# EAGLE design schematic (EAGLE 9.0.1)
CNAME: FPGA NXT ROBOT ARM; CREVISION: A; DESIGNER: Luis Ernesto Fernández

## Sheet 1 of 4: FPGA I/O
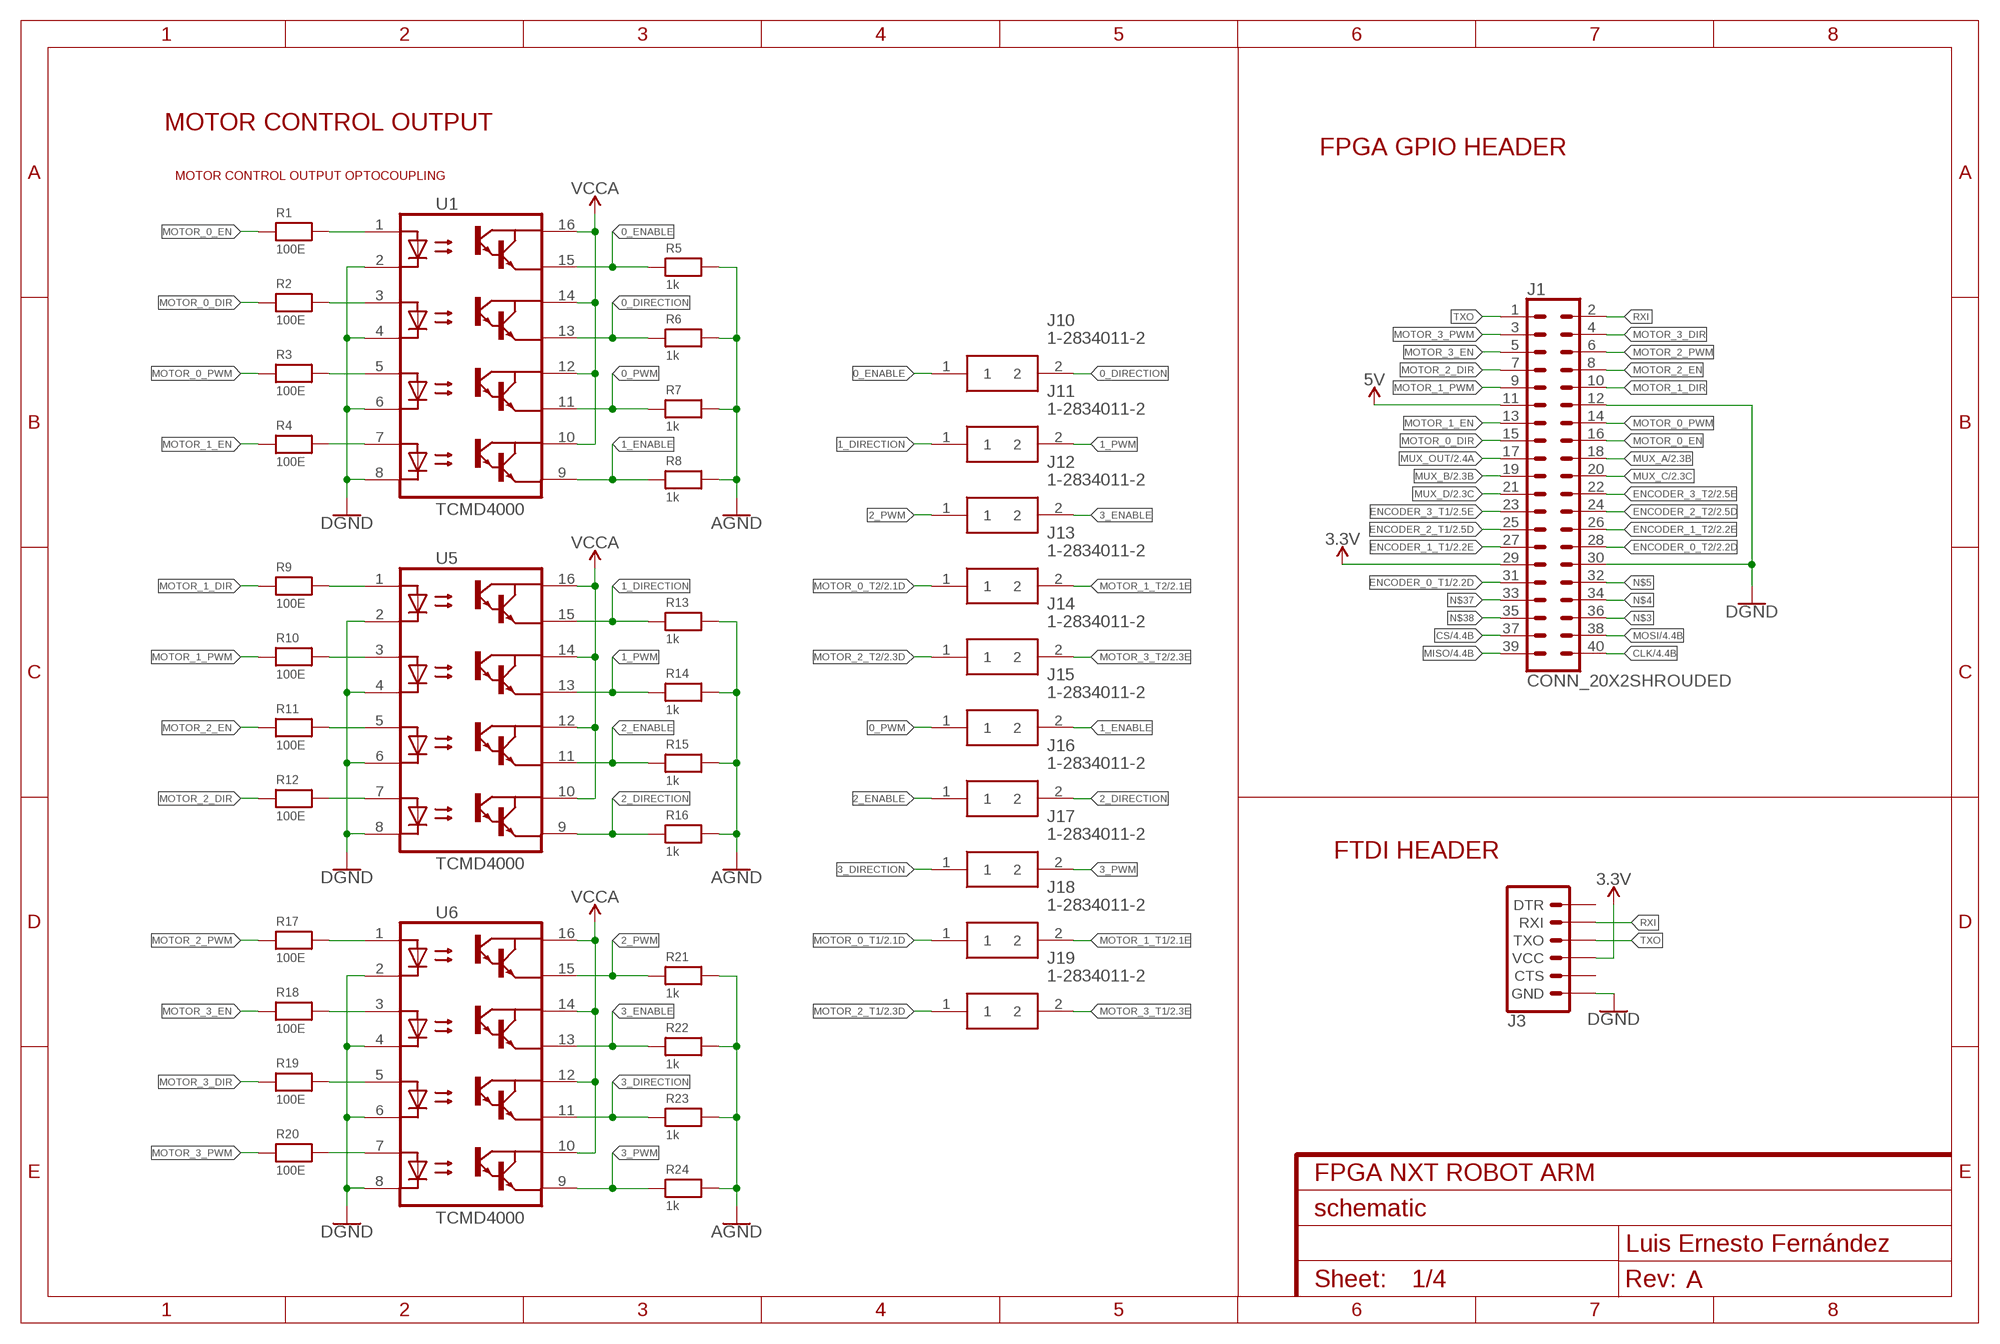
[diagram p0: schematic, sheet 1]

### Parts
J1  CONN_20X2SHROUDED  [2X20_SHROUDED]
J3  6_PIN_SERIAL_TARGET  [1X06]
J10  1-2834011-2  [128340112]
J11  1-2834011-2  [128340112]
J12  1-2834011-2  [128340112]
J13  1-2834011-2  [128340112]
J14  1-2834011-2  [128340112]
J15  1-2834011-2  [128340112]
J16  1-2834011-2  [128340112]
J17  1-2834011-2  [128340112]
J18  1-2834011-2  [128340112]
J19  1-2834011-2  [128340112]
R1  100E  RESISTOR0805_NOTHERMALS  [0805_NOTHERMALS]
R2  100E  RESISTOR0805_NOTHERMALS  [0805_NOTHERMALS]
R3  100E  RESISTOR0805_NOTHERMALS  [0805_NOTHERMALS]
R4  100E  RESISTOR0805_NOTHERMALS  [0805_NOTHERMALS]
R5  1k  RESISTOR0805_NOTHERMALS  [0805_NOTHERMALS]
R6  1k  RESISTOR0805_NOTHERMALS  [0805_NOTHERMALS]
R7  1k  RESISTOR0805_NOTHERMALS  [0805_NOTHERMALS]
R8  1k  RESISTOR0805_NOTHERMALS  [0805_NOTHERMALS]
R9  100E  RESISTOR0805_NOTHERMALS  [0805_NOTHERMALS]
R10  100E  RESISTOR0805_NOTHERMALS  [0805_NOTHERMALS]
R11  100E  RESISTOR0805_NOTHERMALS  [0805_NOTHERMALS]
R12  100E  RESISTOR0805_NOTHERMALS  [0805_NOTHERMALS]
R13  1k  RESISTOR0805_NOTHERMALS  [0805_NOTHERMALS]
R14  1k  RESISTOR0805_NOTHERMALS  [0805_NOTHERMALS]
R15  1k  RESISTOR0805_NOTHERMALS  [0805_NOTHERMALS]
R16  1k  RESISTOR0805_NOTHERMALS  [0805_NOTHERMALS]
R17  100E  RESISTOR0805_NOTHERMALS  [0805_NOTHERMALS]
R18  100E  RESISTOR0805_NOTHERMALS  [0805_NOTHERMALS]
R19  100E  RESISTOR0805_NOTHERMALS  [0805_NOTHERMALS]
R20  100E  RESISTOR0805_NOTHERMALS  [0805_NOTHERMALS]
R21  1k  RESISTOR0805_NOTHERMALS  [0805_NOTHERMALS]
R22  1k  RESISTOR0805_NOTHERMALS  [0805_NOTHERMALS]
R23  1k  RESISTOR0805_NOTHERMALS  [0805_NOTHERMALS]
R24  1k  RESISTOR0805_NOTHERMALS  [0805_NOTHERMALS]
U1  TCMD4000  [SOIC127P686X201-16N]
U5  TCMD4000  [SOIC127P686X201-16N]
U6  TCMD4000  [SOIC127P686X201-16N]

### Nets
0_DIRECTION: J10.2 R6.1 U1.13(E2)
0_ENABLE: J10.1 R5.1 U1.15(E1)
0_PWM: J15.1 R7.1 U1.11(E3)
1_DIRECTION: J11.1 R13.1 U5.15(E1)
1_ENABLE: J15.2 R8.1 U1.9(E4)
1_PWM: J11.2 R14.1 U5.13(E2)
2_DIRECTION: J16.2 R16.1 U5.9(E4)
2_ENABLE: J16.1 R15.1 U5.11(E3)
2_PWM: J12.1 R21.1 U6.15(E1)
3.3V: J1.29 J3.4(VCC) ; also sheet 2,3,4
3_DIRECTION: J17.1 R23.1 U6.11(E3)
3_ENABLE: J12.2 R22.1 U6.13(E2)
3_PWM: J17.2 R24.1 U6.9(E4)
5V: J1.11 ; also sheet 3,4
AGND: R5.2 R6.2 R7.2 R8.2 R13.2 R14.2 R15.2 R16.2 R21.2 R22.2 R23.2 R24.2 ; also sheet 2,3
CLK: J1.40 ; also sheet 4
CS: J1.37 ; also sheet 4
ENCODER_0_T1: J1.31 ; also sheet 2
ENCODER_0_T2: J1.28 ; also sheet 2
ENCODER_1_T1: J1.27 ; also sheet 2
ENCODER_1_T2: J1.26 ; also sheet 2
ENCODER_2_T1: J1.25 ; also sheet 2
ENCODER_2_T2: J1.24 ; also sheet 2
ENCODER_3_T1: J1.23 ; also sheet 2
ENCODER_3_T2: J1.22 ; also sheet 2
GND: J1.12 J1.30 J3.6(GND) U1.2(C1) U1.4(C2) U1.6(C3) U1.8(C4) U5.2(C1) U5.4(C2) U5.6(C3) U5.8(C4) U6.2(C1) U6.4(C2) U6.6(C3) U6.8(C4) ; supply symbol labelled DGND ; also sheet 2,3,4
MISO: J1.39 ; also sheet 4
MOSI: J1.38 ; also sheet 4
MOTOR_0_DIR: J1.15 R2.1
MOTOR_0_EN: J1.16 R1.1
MOTOR_0_PWM: J1.14 R3.1
MOTOR_0_T1: J18.1 ; also sheet 2
MOTOR_0_T2: J13.1 ; also sheet 2
MOTOR_1_DIR: J1.10 R9.1
MOTOR_1_EN: J1.13 R4.1
MOTOR_1_PWM: J1.9 R10.1
MOTOR_1_T1: J18.2 ; also sheet 2
MOTOR_1_T2: J13.2 ; also sheet 2
MOTOR_2_DIR: J1.7 R12.1
MOTOR_2_EN: J1.8 R11.1
MOTOR_2_PWM: J1.6 R17.1
MOTOR_2_T1: J19.1 ; also sheet 2
MOTOR_2_T2: J14.1 ; also sheet 2
MOTOR_3_DIR: J1.4 R19.1
MOTOR_3_EN: J1.5 R18.1
MOTOR_3_PWM: J1.3 R20.1
MOTOR_3_T1: J19.2 ; also sheet 2
MOTOR_3_T2: J14.2 ; also sheet 2
MUX_A: J1.18 ; also sheet 2
MUX_B: J1.19 ; also sheet 2
MUX_C: J1.20 ; also sheet 2
MUX_D: J1.21 ; also sheet 2
MUX_OUT: J1.17 ; also sheet 2
N$3: J1.36
N$4: J1.34
N$5: J1.32
N$37: J1.33
N$38: J1.35
N$57: R1.2 U1.1(A1)
N$58: R2.2 U1.3(A2)
N$59: R3.2 U1.5(A3)
N$60: R4.2 U1.7(A4)
N$118: R9.2 U5.1(A1)
N$119: R10.2 U5.3(A2)
N$120: R11.2 U5.5(A3)
N$121: R12.2 U5.7(A4)
N$122: R17.2 U6.1(A1)
N$123: R18.2 U6.3(A2)
N$124: R19.2 U6.5(A3)
N$125: R20.2 U6.7(A4)
RXI: J1.2 J3.2(RXI)
TXO: J1.1 J3.3(TXO)
VCCA: U1.10(CO4) U1.12(CO3) U1.14(CO2) U1.16(CO1) U5.10(CO4) U5.12(CO3) U5.14(CO2) U5.16(CO1) U6.10(CO4) U6.12(CO3) U6.14(CO2) U6.16(CO1) ; also sheet 2,3
Unconnected: J3.1(DTR) J3.5(CTS)

### Notes on the sheet
- MOTOR CONTROL OUTPUT
- FPGA GPIO HEADER
- MOTOR CONTROL OUTPUT OPTOCOUPLING
- FTDI HEADER

## Sheet 2 of 4: FPGA I/O
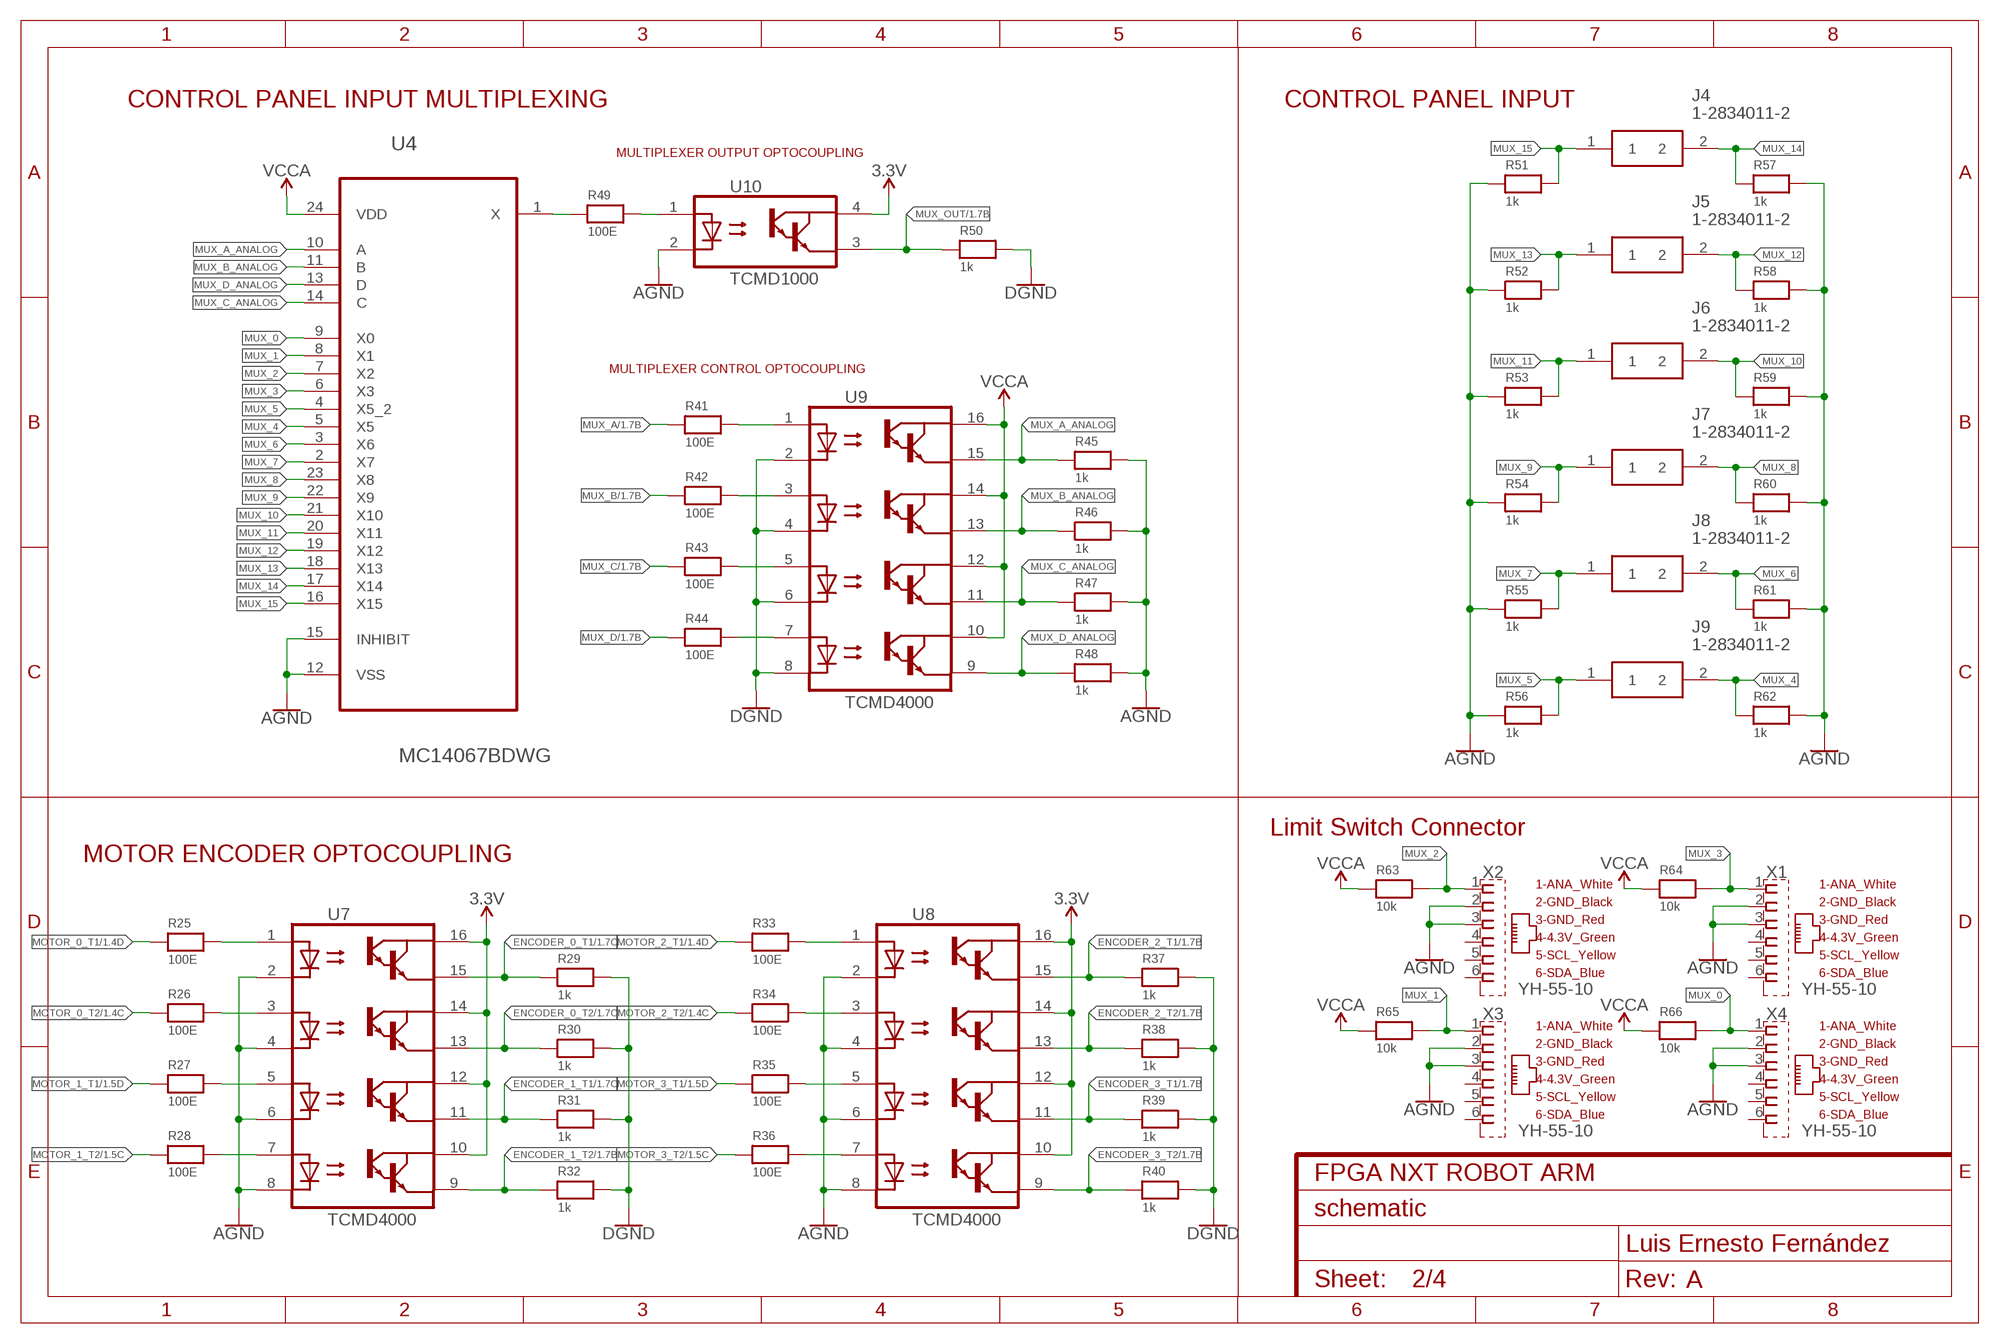
[diagram p1: schematic, sheet 2]

### Parts
J4  1-2834011-2  [128340112]
J5  1-2834011-2  [128340112]
J6  1-2834011-2  [128340112]
J7  1-2834011-2  [128340112]
J8  1-2834011-2  [128340112]
J9  1-2834011-2  [128340112]
R25  100E  RESISTOR0805_NOTHERMALS  [0805_NOTHERMALS]
R26  100E  RESISTOR0805_NOTHERMALS  [0805_NOTHERMALS]
R27  100E  RESISTOR0805_NOTHERMALS  [0805_NOTHERMALS]
R28  100E  RESISTOR0805_NOTHERMALS  [0805_NOTHERMALS]
R29  1k  RESISTOR0805_NOTHERMALS  [0805_NOTHERMALS]
R30  1k  RESISTOR0805_NOTHERMALS  [0805_NOTHERMALS]
R31  1k  RESISTOR0805_NOTHERMALS  [0805_NOTHERMALS]
R32  1k  RESISTOR0805_NOTHERMALS  [0805_NOTHERMALS]
R33  100E  RESISTOR0805_NOTHERMALS  [0805_NOTHERMALS]
R34  100E  RESISTOR0805_NOTHERMALS  [0805_NOTHERMALS]
R35  100E  RESISTOR0805_NOTHERMALS  [0805_NOTHERMALS]
R36  100E  RESISTOR0805_NOTHERMALS  [0805_NOTHERMALS]
R37  1k  RESISTOR0805_NOTHERMALS  [0805_NOTHERMALS]
R38  1k  RESISTOR0805_NOTHERMALS  [0805_NOTHERMALS]
R39  1k  RESISTOR0805_NOTHERMALS  [0805_NOTHERMALS]
R40  1k  RESISTOR0805_NOTHERMALS  [0805_NOTHERMALS]
R41  100E  RESISTOR0805_NOTHERMALS  [0805_NOTHERMALS]
R42  100E  RESISTOR0805_NOTHERMALS  [0805_NOTHERMALS]
R43  100E  RESISTOR0805_NOTHERMALS  [0805_NOTHERMALS]
R44  100E  RESISTOR0805_NOTHERMALS  [0805_NOTHERMALS]
R45  1k  RESISTOR0805_NOTHERMALS  [0805_NOTHERMALS]
R46  1k  RESISTOR0805_NOTHERMALS  [0805_NOTHERMALS]
R47  1k  RESISTOR0805_NOTHERMALS  [0805_NOTHERMALS]
R48  1k  RESISTOR0805_NOTHERMALS  [0805_NOTHERMALS]
R49  100E  RESISTOR0805_NOTHERMALS  [0805_NOTHERMALS]
R50  1k  RESISTOR0805_NOTHERMALS  [0805_NOTHERMALS]
R51  1k  RESISTOR0805_NOTHERMALS  [0805_NOTHERMALS]
R52  1k  RESISTOR0805_NOTHERMALS  [0805_NOTHERMALS]
R53  1k  RESISTOR0805_NOTHERMALS  [0805_NOTHERMALS]
R54  1k  RESISTOR0805_NOTHERMALS  [0805_NOTHERMALS]
R55  1k  RESISTOR0805_NOTHERMALS  [0805_NOTHERMALS]
R56  1k  RESISTOR0805_NOTHERMALS  [0805_NOTHERMALS]
R57  1k  RESISTOR0805_NOTHERMALS  [0805_NOTHERMALS]
R58  1k  RESISTOR0805_NOTHERMALS  [0805_NOTHERMALS]
R59  1k  RESISTOR0805_NOTHERMALS  [0805_NOTHERMALS]
R60  1k  RESISTOR0805_NOTHERMALS  [0805_NOTHERMALS]
R61  1k  RESISTOR0805_NOTHERMALS  [0805_NOTHERMALS]
R62  1k  RESISTOR0805_NOTHERMALS  [0805_NOTHERMALS]
R63  10k  RESISTOR0805_NOTHERMALS  [0805_NOTHERMALS]
R64  10k  RESISTOR0805_NOTHERMALS  [0805_NOTHERMALS]
R65  10k  RESISTOR0805_NOTHERMALS  [0805_NOTHERMALS]
R66  10k  RESISTOR0805_NOTHERMALS  [0805_NOTHERMALS]
U4  MC14067BDWG  [SOIC127P1030X265-24N]
U7  TCMD4000  [SOIC127P686X201-16N]
U8  TCMD4000  [SOIC127P686X201-16N]
U9  TCMD4000  [SOIC127P686X201-16N]
U10  TCMD1000  [SOIC254P695X210-4N]
X1  YH-55-10  [YH-55-10]
X2  YH-55-10  [YH-55-10]
X3  YH-55-10  [YH-55-10]
X4  YH-55-10  [YH-55-10]

### Nets
3.3V: U7.10(CO4) U7.12(CO3) U7.14(CO2) U7.16(CO1) U8.10(CO4) U8.12(CO3) U8.14(CO2) U8.16(CO1) U10.4(CO1) ; also sheet 1,3,4
AGND: R45.2 R46.2 R47.2 R48.2 R51.1 R52.1 R53.1 R54.1 R55.1 R56.1 R57.2 R58.2 R59.2 R60.2 R61.2 R62.2 U4.12(VSS) U4.15(INHIBIT) U7.2(C1) U7.4(C2) U7.6(C3) U7.8(C4) U8.2(C1) U8.4(C2) U8.6(C3) U8.8(C4) U10.2(C1) X1.2(2_GND_BLACK) X1.3(3_GND_RED) X2.2(2_GND_BLACK) X2.3(3_GND_RED) X3.2(2_GND_BLACK) X3.3(3_GND_RED) X4.2(2_GND_BLACK) X4.3(3_GND_RED) ; also sheet 1,3
ENCODER_0_T1: R29.1 U7.15(E1) ; also sheet 1
ENCODER_0_T2: R30.1 U7.13(E2) ; also sheet 1
ENCODER_1_T1: R31.1 U7.11(E3) ; also sheet 1
ENCODER_1_T2: R32.1 U7.9(E4) ; also sheet 1
ENCODER_2_T1: R37.1 U8.15(E1) ; also sheet 1
ENCODER_2_T2: R38.1 U8.13(E2) ; also sheet 1
ENCODER_3_T1: R39.1 U8.11(E3) ; also sheet 1
ENCODER_3_T2: R40.1 U8.9(E4) ; also sheet 1
GND: R29.2 R30.2 R31.2 R32.2 R37.2 R38.2 R39.2 R40.2 R50.2 U9.2(C1) U9.4(C2) U9.6(C3) U9.8(C4) ; supply symbol labelled DGND ; also sheet 1,3,4
MOTOR_0_T1: R25.1 ; also sheet 1
MOTOR_0_T2: R26.1 ; also sheet 1
MOTOR_1_T1: R27.1 ; also sheet 1
MOTOR_1_T2: R28.1 ; also sheet 1
MOTOR_2_T1: R33.1 ; also sheet 1
MOTOR_2_T2: R34.1 ; also sheet 1
MOTOR_3_T1: R35.1 ; also sheet 1
MOTOR_3_T2: R36.1 ; also sheet 1
MUX_0: R66.2 U4.9(X0) X4.1(1_ANA_WHITE)
MUX_1: R65.2 U4.8(X1) X3.1(1_ANA_WHITE)
MUX_2: R63.2 U4.7(X2) X2.1(1_ANA_WHITE)
MUX_3: R64.2 U4.6(X3) X1.1(1_ANA_WHITE)
MUX_4: J9.2 R62.1 U4.5(X5)
MUX_5: J9.1 R56.2 U4.4(X5_2)
MUX_6: J8.2 R61.1 U4.3(X6)
MUX_7: J8.1 R55.2 U4.2(X7)
MUX_8: J7.2 R60.1 U4.23(X8)
MUX_9: J7.1 R54.2 U4.22(X9)
MUX_10: J6.2 R59.1 U4.21(X10)
MUX_11: J6.1 R53.2 U4.20(X11)
MUX_12: J5.2 R58.1 U4.19(X12)
MUX_13: J5.1 R52.2 U4.18(X13)
MUX_14: J4.2 R57.1 U4.17(X14)
MUX_15: J4.1 R51.2 U4.16(X15)
MUX_A: R41.1 ; also sheet 1
MUX_A_ANALOG: R45.1 U4.10(A) U9.15(E1)
MUX_B: R42.1 ; also sheet 1
MUX_B_ANALOG: R46.1 U4.11(B) U9.13(E2)
MUX_C: R43.1 ; also sheet 1
MUX_C_ANALOG: R47.1 U4.14(C) U9.11(E3)
MUX_D: R44.1 ; also sheet 1
MUX_D_ANALOG: R48.1 U4.13(D) U9.9(E4)
MUX_OUT: R50.1 U10.3(E1) ; also sheet 1
N$69: R33.2 U8.1(A1)
N$70: R34.2 U8.3(A2)
N$71: R35.2 U8.5(A3)
N$80: R49.1 U4.1(X)
N$81: R36.2 U8.7(A4)
N$82: R49.2 U10.1(A1)
N$83: R41.2 U9.1(A1)
N$126: R25.2 U7.1(A1)
N$127: R26.2 U7.3(A2)
N$128: R27.2 U7.5(A3)
N$129: R28.2 U7.7(A4)
N$130: R42.2 U9.3(A2)
N$131: R43.2 U9.5(A3)
N$132: R44.2 U9.7(A4)
VCCA: R63.1 R64.1 R65.1 R66.1 U4.24(VDD) U9.10(CO4) U9.12(CO3) U9.14(CO2) U9.16(CO1) ; also sheet 1,3
Unconnected: X1.4(4_4.3V_GREEN) X1.5(5_SCL_YELLOW) X1.6(6_SDA_BLUE) X2.4(4_4.3V_GREEN) X2.5(5_SCL_YELLOW) X2.6(6_SDA_BLUE) X3.4(4_4.3V_GREEN) X3.5(5_SCL_YELLOW) X3.6(6_SDA_BLUE) X4.4(4_4.3V_GREEN) X4.5(5_SCL_YELLOW) X4.6(6_SDA_BLUE)

### Notes on the sheet
- CONTROL PANEL INPUT MULTIPLEXING | CONTROL PANEL INPUT
- MULTIPLEXER OUTPUT OPTOCOUPLING
- MULTIPLEXER CONTROL OPTOCOUPLING
- Limit Switch Connector
- MOTOR ENCODER OPTOCOUPLING

## Sheet 3 of 4: POWER DELIVERY
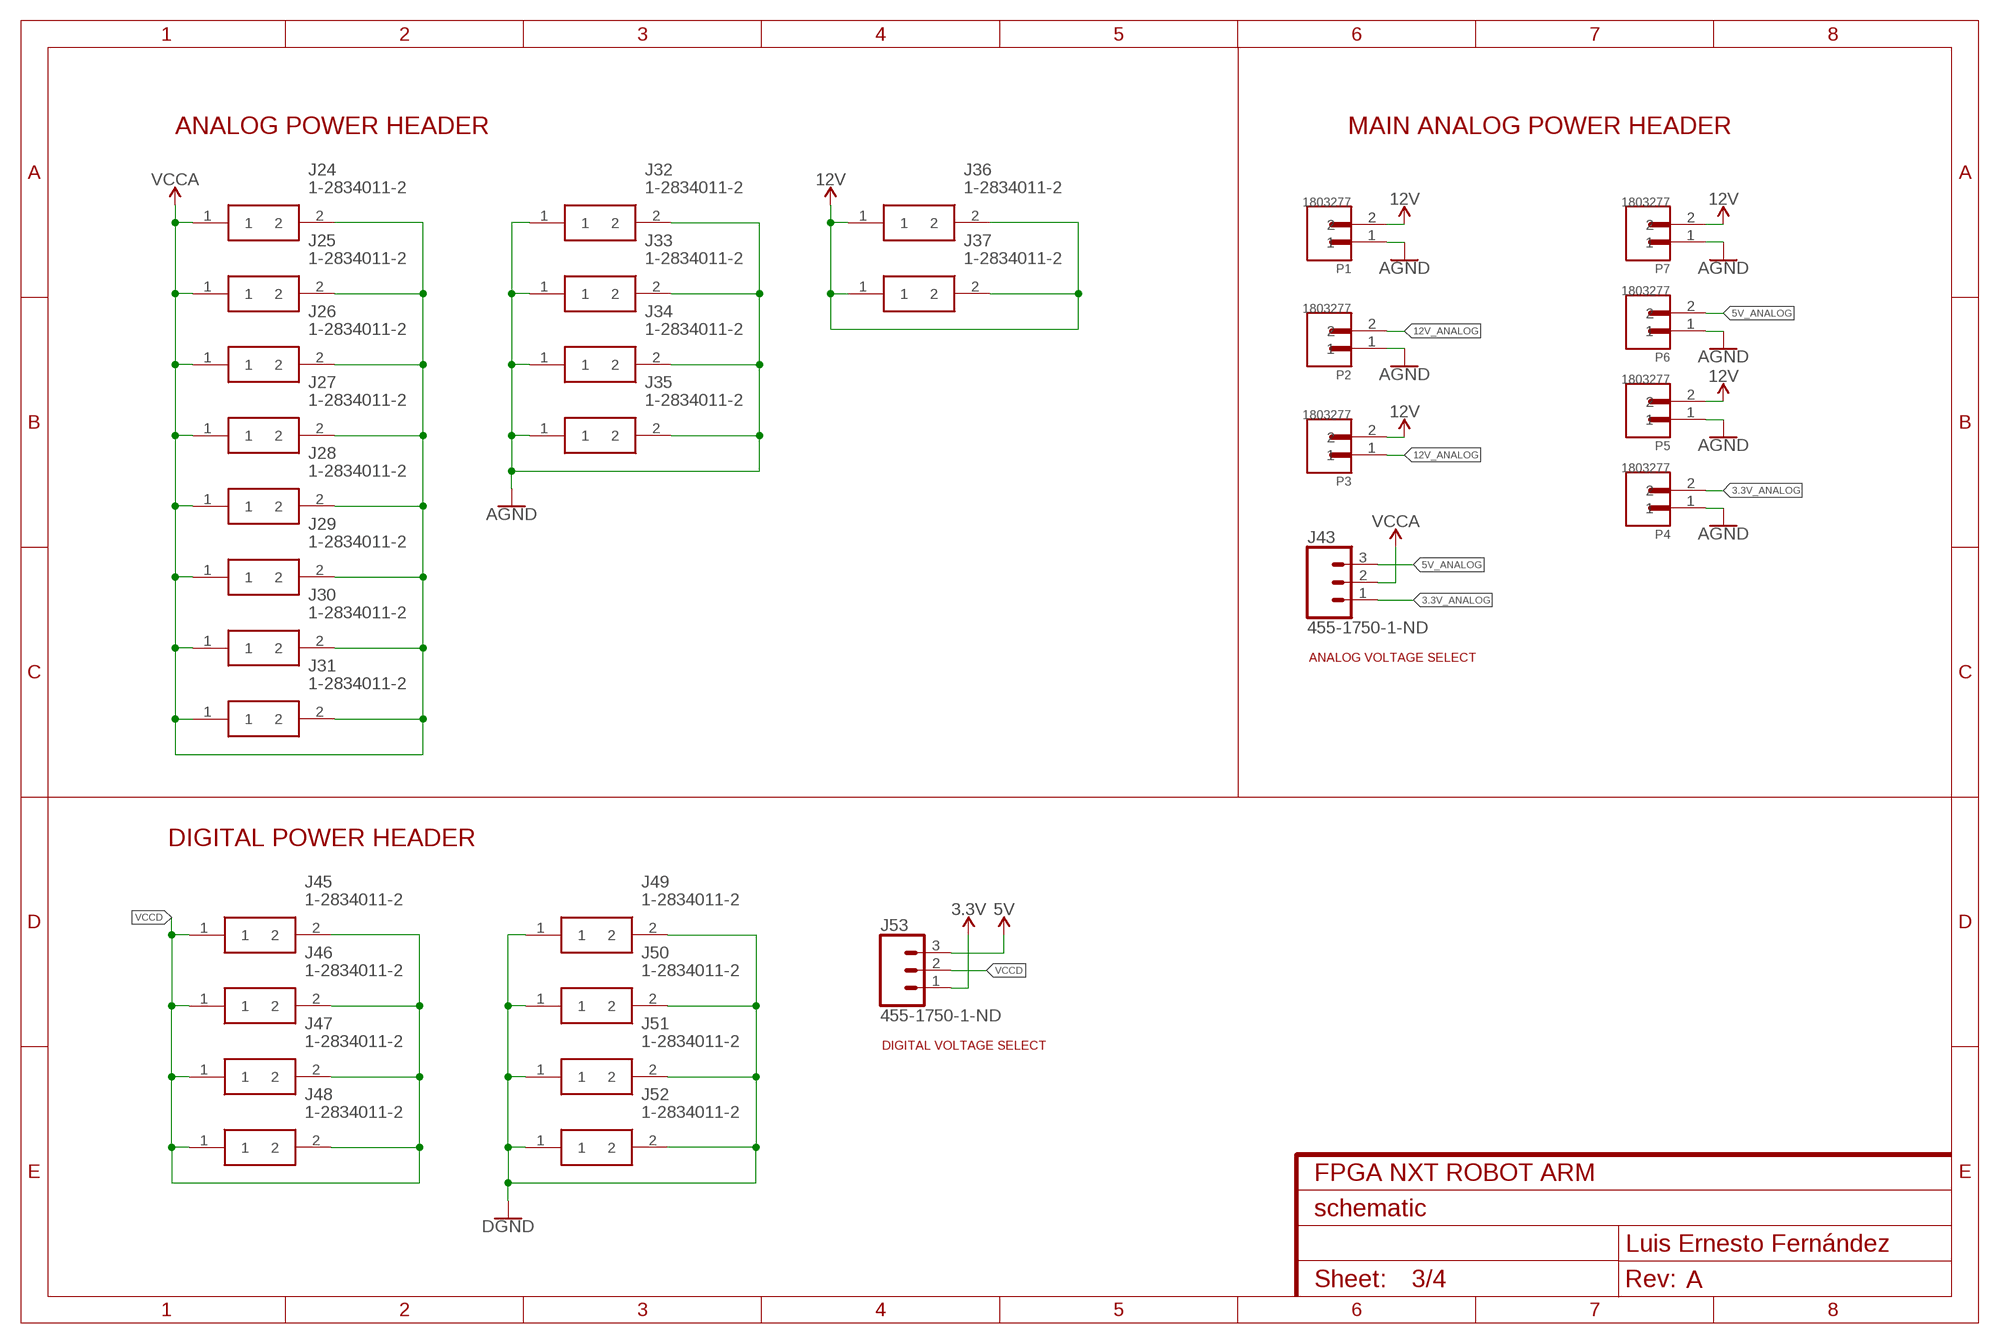
[diagram p2: schematic, sheet 3]

### Parts
J24  1-2834011-2  [128340112]
J25  1-2834011-2  [128340112]
J26  1-2834011-2  [128340112]
J27  1-2834011-2  [128340112]
J28  1-2834011-2  [128340112]
J29  1-2834011-2  [128340112]
J30  1-2834011-2  [128340112]
J31  1-2834011-2  [128340112]
J32  1-2834011-2  [128340112]
J33  1-2834011-2  [128340112]
J34  1-2834011-2  [128340112]
J35  1-2834011-2  [128340112]
J36  1-2834011-2  [128340112]
J37  1-2834011-2  [128340112]
J43  455-1750-1-ND  CONN_03  [1X03]
J45  1-2834011-2  [128340112]
J46  1-2834011-2  [128340112]
J47  1-2834011-2  [128340112]
J48  1-2834011-2  [128340112]
J49  1-2834011-2  [128340112]
J50  1-2834011-2  [128340112]
J51  1-2834011-2  [128340112]
J52  1-2834011-2  [128340112]
J53  455-1750-1-ND  CONN_03  [1X03]
P1  1803277  [PHOENIX_1803277]
P2  1803277  [PHOENIX_1803277]
P3  1803277  [PHOENIX_1803277]
P4  1803277  [PHOENIX_1803277]
P5  1803277  [PHOENIX_1803277]
P6  1803277  [PHOENIX_1803277]
P7  1803277  [PHOENIX_1803277]

### Nets
3.3V: J53.1 ; also sheet 1,2,4
3.3V_ANALOG: J43.1 P4.2
5V: J53.3 ; also sheet 1,4
5V_ANALOG: J43.3 P6.2
12V: J36.1 J36.2 J37.1 J37.2 P1.2 P3.2 P5.2 P7.2
12V_ANALOG: P2.2 P3.1
AGND: J32.1 J32.2 J33.1 J33.2 J34.1 J34.2 J35.1 J35.2 P1.1 P2.1 P4.1 P5.1 P6.1 P7.1 ; also sheet 1,2
GND: J49.1 J49.2 J50.1 J50.2 J51.1 J51.2 J52.1 J52.2 ; supply symbol labelled DGND ; also sheet 1,2,4
VCCA: J24.1 J24.2 J25.1 J25.2 J26.1 J26.2 J27.1 J27.2 J28.1 J28.2 J29.1 J29.2 J30.1 J30.2 J31.1 J31.2 J43.2 ; also sheet 1,2
VCCD: J45.1 J45.2 J46.1 J46.2 J47.1 J47.2 J48.1 J48.2 J53.2

### Notes on the sheet
- ANALOG POWER HEADER | MAIN ANALOG POWER HEADER
- ANALOG VOLTAGE SELECT
- DIGITAL POWER HEADER
- DIGITAL VOLTAGE SELECT

## Sheet 4 of 4: ADC
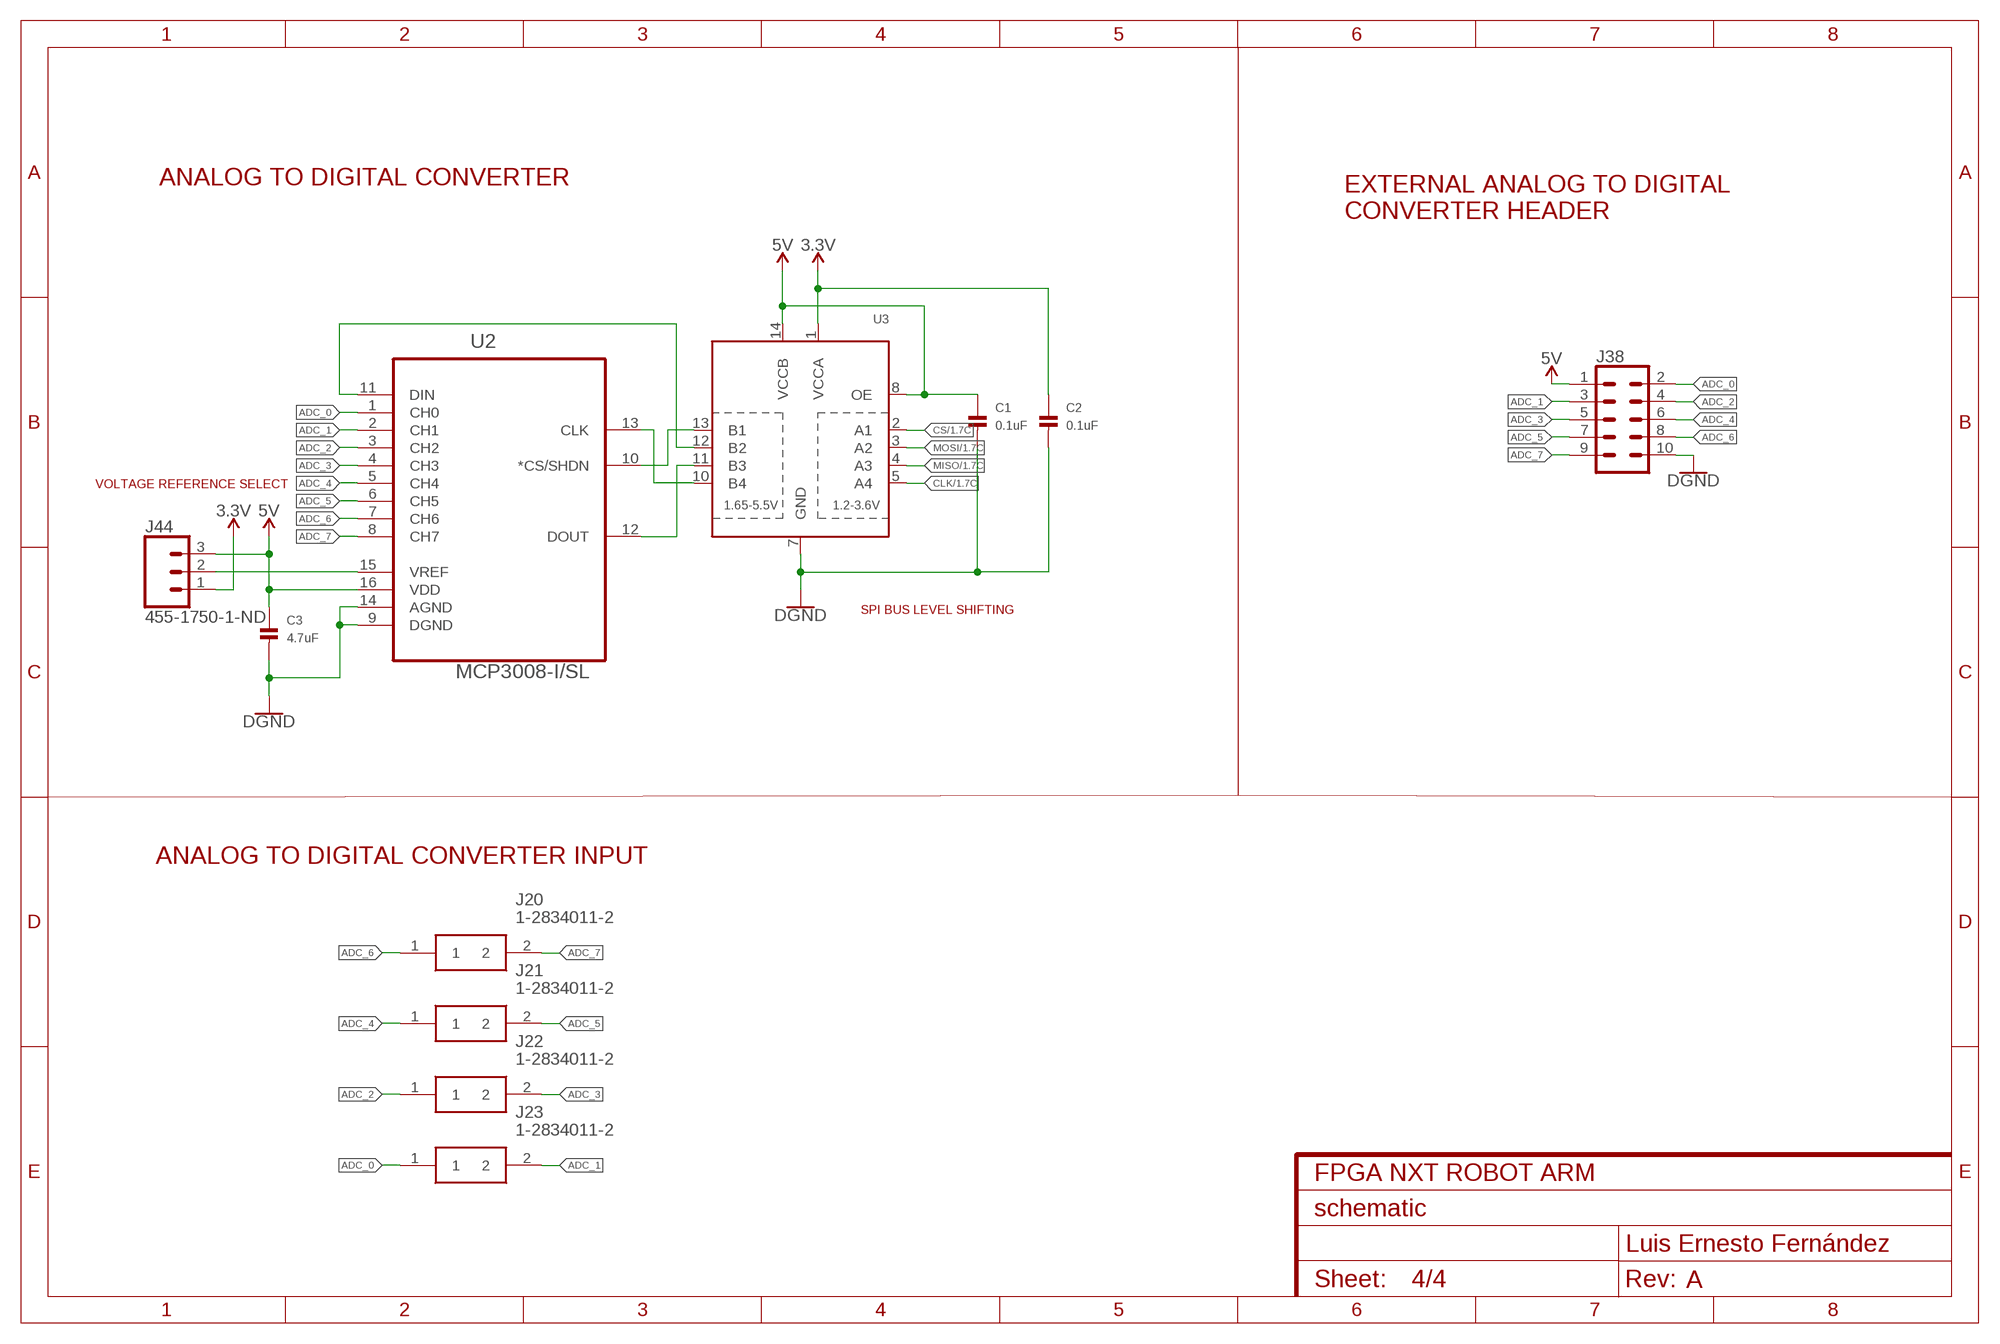
[diagram p3: schematic, sheet 4]

### Parts
C1  0.1uF  CAP_CERAMIC0805-NOTHERMALS  [0805_NOTHERMALS]
C2  0.1uF  CAP_CERAMIC0805-NOTHERMALS  [0805_NOTHERMALS]
C3  4.7uF  CAP_CERAMIC0805-NOTHERMALS  [0805_NOTHERMALS]
J20  1-2834011-2  [128340112]
J21  1-2834011-2  [128340112]
J22  1-2834011-2  [128340112]
J23  1-2834011-2  [128340112]
J38  CONN_05X2SHD  [2X5-SHROUDED]
J44  455-1750-1-ND  CONN_03  [1X03]
U2  MCP3008-I/SL  [SOIC127P600X175-16N]
U3  TXB0104PWR  [TSSOP14]

### Nets
3.3V: C2.1 J44.1 U3.1(VCCA) ; also sheet 1,2,3
5V: C1.1 C3.1 J38.1 J44.3 U2.16(VDD) U3.8(OE) U3.14(VCCB) ; also sheet 1,3
ADC_0: J23.1 J38.2 U2.1(CH0)
ADC_1: J23.2 J38.3 U2.2(CH1)
ADC_2: J22.1 J38.4 U2.3(CH2)
ADC_3: J22.2 J38.5 U2.4(CH3)
ADC_4: J21.1 J38.6 U2.5(CH4)
ADC_5: J21.2 J38.7 U2.6(CH5)
ADC_6: J20.1 J38.8 U2.7(CH6)
ADC_7: J20.2 J38.9 U2.8(CH7)
CLK: U3.5(A4) ; also sheet 1
CS: U3.2(A1) ; also sheet 1
GND: C1.2 C2.2 C3.2 J38.10 U2.9(DGND) U2.14(AGND) U3.7(GND) ; supply symbol labelled DGND ; also sheet 1,2,3
MISO: U3.4(A3) ; also sheet 1
MOSI: U3.3(A2) ; also sheet 1
N$1: U2.10(*CS/SHDN) U3.13(B1)
N$2: U2.12(DOUT) U3.11(B3)
N$6: U2.13(CLK) U3.10(B4)
N$15: U2.11(DIN) U3.12(B2)
N$112: J44.2 U2.15(VREF)

### Notes on the sheet
- ANALOG TO DIGITAL CONVERTER
- EXTERNAL ANALOG TO DIGITAL
  CONVERTER HEADER
- VOLTAGE REFERENCE SELECT
- SPI BUS LEVEL SHIFTING
- ANALOG TO DIGITAL CONVERTER INPUT

## Library data of the parts
C1-C3 = microbuilder:CAP_CERAMIC: Ceramic Capacitors 0402 - 0402 Surface Mount Capacitors 16pF 50V 5% [Digikey: 445-4899-2-ND] 18pF 50V 5% [Digikey: 490-1281-2-ND] 22pF 50V 5% [Digikey: 490-1283-2-ND] 68pF 50V 5% [Digikey: 490-1289-2-ND] 0.1uF 10V 10% [Digikey: 490-1318-2-ND] 1.0uF 6.3V 10% [Digikey: 490-1320-2-ND] 0603 - 0603 Surface Mount Capacitors 16 pF 50V 5% [Digikey: 445-5051-2-ND] 22 pF 50V [Digikey: PCC220ACVTR-ND] 33 pF 50V 5% [Digikey: 490-1415-1-ND] 56pF 50V 5% [Digikey: 490-1421-1-ND] 220pF 50V 5% [Digikey: 445-1285-1-ND] 680 pF 50V 2200 pF 50V 5% C0G [Digikey: 445-1297-1-ND] 5600 pF 100V 5% X7R [Digikey: 478-3711-1-ND] 0.1 µF 25V 10% [Digikey: PCC2277TR-ND] 0.22 µF 16V 10% X7R [Digikey: 445-1318-1-ND] 1.0 µF 25V 10% [Digikey: 445-5146-2-ND] 0603 - RF Specific 3pF 250V +/-0.1pF RF [Digikey: 712-1347-1-ND] 18 pF 250V 5% [Digikey: 478-3505-1-ND or 712-1322-1-ND] 56 pF 250V 5% C0G RF [Digikey: 490-4867-1-ND] 68 pF 250V RF [Digikey: 490-4868-1-ND] 0805 - 0805 Surface Mount Capacitors 220 pF 250V 2% RF Ceramic Capacitor [Digikey: 712-1398-1-ND] 1000 pF 50V 2% NP0 Ceramic Capacitor [Digikey: 478-3760-1-ND] 0.1 µF 25V 10% Ceramic Capacitor [Digikey: PCC1828TR-ND] 1.0 µF 16V 10% Ceramic Capacitor[Digikey: 490-1691-2-ND] 10.0 µF 10V 10% Ceramic Capacitor[Digikey: 709-1228-1-ND] 10.0 uF 16V 10% Ceramic Capacitor [Digikey: 478-5165-2-ND] 47 uF 6.3V 20% Ceramic Capacitor [Digikey: 587-1779-1-ND or 399-5506-1-ND] 1206 - 1206 Surface Mount Capacitors 47uF 10V 20% Ceramic Capacitor [Digikey: 490-5528-1-ND or 399-5508-1-ND or 445-6010-1-ND] 100uF 6.3V -20%, +80% Y5V Ceramic Capacitor (Digikey: 490-4512-1-ND, Mouser: 81-GRM31CF50J107ZE1L)
J1 = SparkFun-Connectors:CONN_20X2: Multi connection point. Often used as Generic Header-pin footprint for 0.1 inch spaced/style header connections On any of the 0.1 inch spaced packages, you can populate with these: Break Away Headers - Straight <https://www.sparkfun.com/products/116> (PRT-00116) Break Away Male Headers - Right Angle <https://www.sparkfun.com/products/553> (PRT-00553) Female Headers <https://www.sparkfun.com/products/115> (PRT-00115) Break Away Headers - Machine Pin <https://www.sparkfun.com/products/117> (PRT-00117) Break Away Female Headers - Swiss Machine Pin <https://www.sparkfun.com/products/743> (PRT-00743); PROD_ID: CONN-12263; SF_ID: CONN-12263
J3 = SparkFun-Connectors:6_PIN_SERIAL_TARGET: 6-pin header connection for use with the "FTDI BASIC" pinout - TARGET SIDE. Also known as "Arduino Serial Program Header". It is used to mate with our FTDI Basic serial programmers using the Arduino IDE. Note, this device has "TARGET" in the name. It is intended to be used on a design that contains a target micro-controller that you wish to program. The "sister" device, named "CABLE" is inteneded to be used on a design that usually lives on the end of your USB cable and prvides the converter chip (FTDI232 or FTDI231x) to commnicate serial RX/TX. You can populate with some of these: Break Away Headers - Straight <https://www.sparkfun.com/products/116> (PRT-00116) For reference (or to suit your programming needs) check out these designs: SparkFun FTDI Basic Breakout - 5V <https://www.sparkfun.com/products/9716> (DEV-09716) SparkFun FTDI Basic Breakout - 3.3V <https://www.sparkfun.com/products/9873> (DEV-09873) SparkFun FTDI SmartBasic <https://www.sparkfun.com/products/12935> (DEV-12935) SparkFun Beefy 3 - FTDI Basic Breakout <https://www.sparkfun.com/products/13746> (DEV-13746)
J4-J37 J45-J52 = 1-2834011-2:1-2834011-2: 2P 3.5mm Top Entry Screwless Connector. TE Connectivity 3.5mm Pitch Vertical PCB Terminal Block with Solder Termination, Through Hole, 2 Way Source: Datasheet <http://www.te.com/commerce/DocumentDelivery/DDEController?Action=showdoc&DocId=Customer Drawing2834011BpdfEnglishENG_CD_2834011_B.pdf1-2834011-2>; ARROW_PART_NUMBER: 1-2834011-2; ARROW_PRICE/STOCK: https://www.arrow.com/en/products/1-2834011-2/te-connectivity; DESCRIPTION: 2P 3.5mm Top Entry Screwless Connector. TE Connectivity 3.5mm Pitch Vertical PCB Terminal Block with Solder Termination, Through Hole, 2 Way; HEIGHT: 11mm; MANUFACTURER_NAME: TE Connectivity; MANUFACTURER_PART_NUMBER: 1-2834011-2; RS_PART_NUMBER: 1649131; RS_PRICE/STOCK: http://uk.rs-online.com/web/p/products/1649131
J38 = SparkFun-Connectors:CONN_05X2: Multi connection point. Often used as Generic Header-pin footprint for 0.1 inch spaced/style header connections For AVR SPI programming port, see special device with nice symbol: "AVR_SPI_PROG_5x2.dev" You can populate with any combo of single row headers, but if you'd like an exact match, check these: 2x5 AVR ICSP Male Header <https://www.sparkfun.com/products/778> (PRT-00778) 2x5 Pin Shrouded Header <https://www.sparkfun.com/products/8506> (PRT-08506) On any of the 0.1 inch spaced packages, you can populate with these: Break Away Headers - Straight <https://www.sparkfun.com/products/116> (PRT-00116) Break Away Male Headers - Right Angle <https://www.sparkfun.com/products/553> (PRT-00553) Female Headers <https://www.sparkfun.com/products/115> (PRT-00115) Break Away Headers - Machine Pin <https://www.sparkfun.com/products/117> (PRT-00117) Break Away Female Headers - Swiss Machine Pin <https://www.sparkfun.com/products/743> (PRT-00743) Special note: the shrouded connector mates well with our 5x2 ribbon cables: 2x5 Pin IDC Ribbon Cable <https://www.sparkfun.com/products/8535> (PRT-08535); PROD_ID: CONN-08671; SF_ID: PRT-08506
J43 J44 J53 = SparkFun-Connectors:CONN_03: Multi connection point. Often used as Generic Header-pin footprint for 0.1 inch spaced/style header connections On any of the 0.1 inch spaced packages, you can populate with these: Break Away Headers - Straight <https://www.sparkfun.com/products/116> (PRT-00116) Break Away Male Headers - Right Angle <https://www.sparkfun.com/products/553> (PRT-00553) Female Headers <https://www.sparkfun.com/products/115> (PRT-00115) Break Away Headers - Machine Pin <https://www.sparkfun.com/products/117> (PRT-00117) Break Away Female Headers - Swiss Machine Pin <https://www.sparkfun.com/products/743> (PRT-00743) Stackable Header - 3 Pin (Female, 0.1") <https://www.sparkfun.com/products/13875> (PRT-13875) For SCREWTERMINALS and SPRING TERMINALS visit here: Screw Terimnals on SparkFun.com <https://www.sparkfun.com/search/results?term=Screw+Terminals> (5mm/3.5mm/2.54mm spacing) This device is also useful as a general connection point to wire up your design to another part of your project. Our various solder wires solder well into these plated through hole pads. Hook-Up Wire - Assortment (Stranded, 22 AWG) <https://www.sparkfun.com/products/11375> (PRT-11375) Hook-Up Wire - Assortment (Solid Core, 22 AWG) <https://www.sparkfun.com/products/11367> (PRT-11367) View the entire wire category on our website here <https://www.sparkfun.com/categories/141> Special notes: Molex polarized connector foot print use with SKU : PRT-08232 with associated crimp pins and housings.; PROD_ID: XXX-00000
P1-P7 = 1803277:1803277: Mini-Combicon Series Plug In Parallel To Pcb 2pos 8a 160vac Green Plastic Housing 3.81mm Pitch 3.81mm Length; AVAILABILITY: Bad; DESCRIPTION: Gel Highlighter Set 5 Colour s; MF: Phoenix Contact; MP: 1803277; PACKAGE: FakePackage N; PRICE: 13.65 USD
R1-R66 = microbuilder:RESISTOR: Resistors 0402 - 0402 Surface Mount Package 22 Ohm 1% 1/16W [Digikey: 311-22.0LRTR-ND] 33 Ohm 5% 1/16W 1.0K 5% 1/16W 1.5K 5% 1/16W 2.0K 1% 1/16W 10.0K 1% 1/16W [Digikey: 311-10.0KLRTR-ND] 10.0K 5% 1/16W [Digikey: RMCF0402JT10K0TR-ND] 12.1K 1% 1/16W [Digikey: 311-22.0LRTR-ND] 100.0K 5% 1/16W 0603 - 0603 Surface Mount Package 0 Ohm 1/10 Watt 1% Resistor 15 Ohm 1/10 Watt 1% Resistor 33 Ohm 1/10 Watt 1% Resistor 49.9 Ohm 1/10 Watt 1% Resistor 100 Ohm 1/10 Watt 1% Resistor 150 Ohm 1/10 Watt 1% Resistor 240 Ohm 1/10 Watt 1% Resistor 390 Ohm 1/10 Watt 1% Resistor 560 Ohm 1/10 Watt 1% Resistor 680 Ohm 1/10 Watt 1% Resistor 750 Ohm 1/10 Watt 1% Resistor 1.0K Ohm 1/10 Watt 1% Resistor 1.5K Ohm 1/10 Watt 1% Resistor 2.0K Ohm 1/10 Watt 1% Resistor 2.2K Ohm 1/10 Watt 1% Resistor 3.3K Ohm 1/10 Watt 1% Resistor 4.7K Ohm 1/10 Watt 1% Resistor 10.0K Ohm 1/10 Watt 1% Resistor 12.0K Ohm 1/10 Watt 1% Resistor 12.1K Ohm 1/10 Watt 1% Resistor 20.0K Ohm 1/10 Watt 1% Resistor 33.0K Ohm 1/10 Watt 1% Resistor 100.0K Ohm 1/10 Watt 1% Resistor 0805 - 0805 Surface Mount Package 0 Ohm 1/8 Watt 1% Resistor 33 Ohm 1/8 Watt 1% Resistor 100 Ohm 1/8 Watt 1% Resistor 150 Ohm 1/8 Watt 1% Resistor 200 Ohm 1/8 Watt 1% Resistor 240 Ohm 1/8 Watt 1% Resistor 330 Ohm 1/8 Watt 1% Resistor 390 Ohm 1/8 Watt 1% Resistor 470 Ohm 1/8 Watt 1% Resistor 1.0K Ohm 1/8 Watt 1% Resistor 1.5K Ohm 1/8 Watt 1% Resistor 2.0K Ohm 1/8 Watt 1% Resistor 4.7K Ohm 1/8 Watt 1% Resistor 5.1K Ohm 1/8 Watt 1% Resistor 5.6K Ohm 1/8 Watt 1% Resistor 10.0K Ohm 1/8 Watt 1% Resistor 22.0K Ohm 1/8 Watt 1% Resistor 33.0K Ohm 1/8 Watt 1% Resistor 100K Ohm 1/8 Watt 1% Resistor 1206 - 1206 Surface Mount Package 2012 - 2010 Surface Mount Package 0.11 Ohm 1/2 Watt 1% Resistor - Digikey: RHM.11UCT-ND
U1 U5-U9 = TCMD4000:TCMD4000: Optocoupler, Photodarlington Output, High Gain, Single/Quad Channel, Half Pitch Mini-Flat Package; AVAILABILITY: Good; DESCRIPTION: TCMD4000 Series Quad Channel 35V 3750 Vrms Photodarlington Optocoupler - SOIC-16; MF: Vishay Semiconductor; MP: TCMD4000; PACKAGE: SOP-16 Vishay Semiconductor; PRICE: 1.38 USD
U2 = MCP3008-I_SL:MCP3008-I/SL: 10BIT ADC, 8 CH, SPI, SMD; AVAILABILITY: Good; DESCRIPTION: Eight Channel SPI Serial Interface 2.7 V 10-Bit A/D Converter SMT - SOIC-16; MF: Microchip; MP: MCP3008-I/SL; PACKAGE: SOIC-16 Microchip; PRICE: 2.09 USD
U3 = adafruit:TXB0104PWR: 4-Bit Bi-Directional Level Shifter 1.2V-3.6V (VCCA) to 1.65V-5.5V (VCCB) bi-directional level shifter with auto direction sensing. Max data rate - VCCA 1.8V: 20Mbps (50ns), VCCA 3.3V: 100Mbps (10ns) Digikey: 296-21929-1-ND
U4 = ON Semiconductor_By_element14_Batch_1:MC14067BDWG: Analog Multiplexers/Demultiplexers; MPN: MC14067BDWG; OC_FARNELL: 9664882; OC_NEWARK: 45J1070; PACKAGE: SOIC-24; SUPPLIER: On Semiconductor
U10 = TCMD1000:TCMD1000: Optocoupler, Photodarlington Output, High Gain, Single Channel, Half Pitch Mini-Flat Package; AVAILABILITY: Good; DESCRIPTION: Single Channel 35 V 3750 Vrms 600% CTR Photodarlington Optocoupler - SOP-4; MF: Vishay; MP: TCMD1000; PACKAGE: SOP-4 Vishay; PRICE: 0.40 USD
X1-X4 = Dexter_Industries_Eagle_Library_Female_Sockets:YH-55-10: RJ11 6 connects Source:Dexter Industries LEGO MINDSTORMS NXT Female Adapter; OC_FARNELL: unknown; OC_NEWARK: unknown

## Board
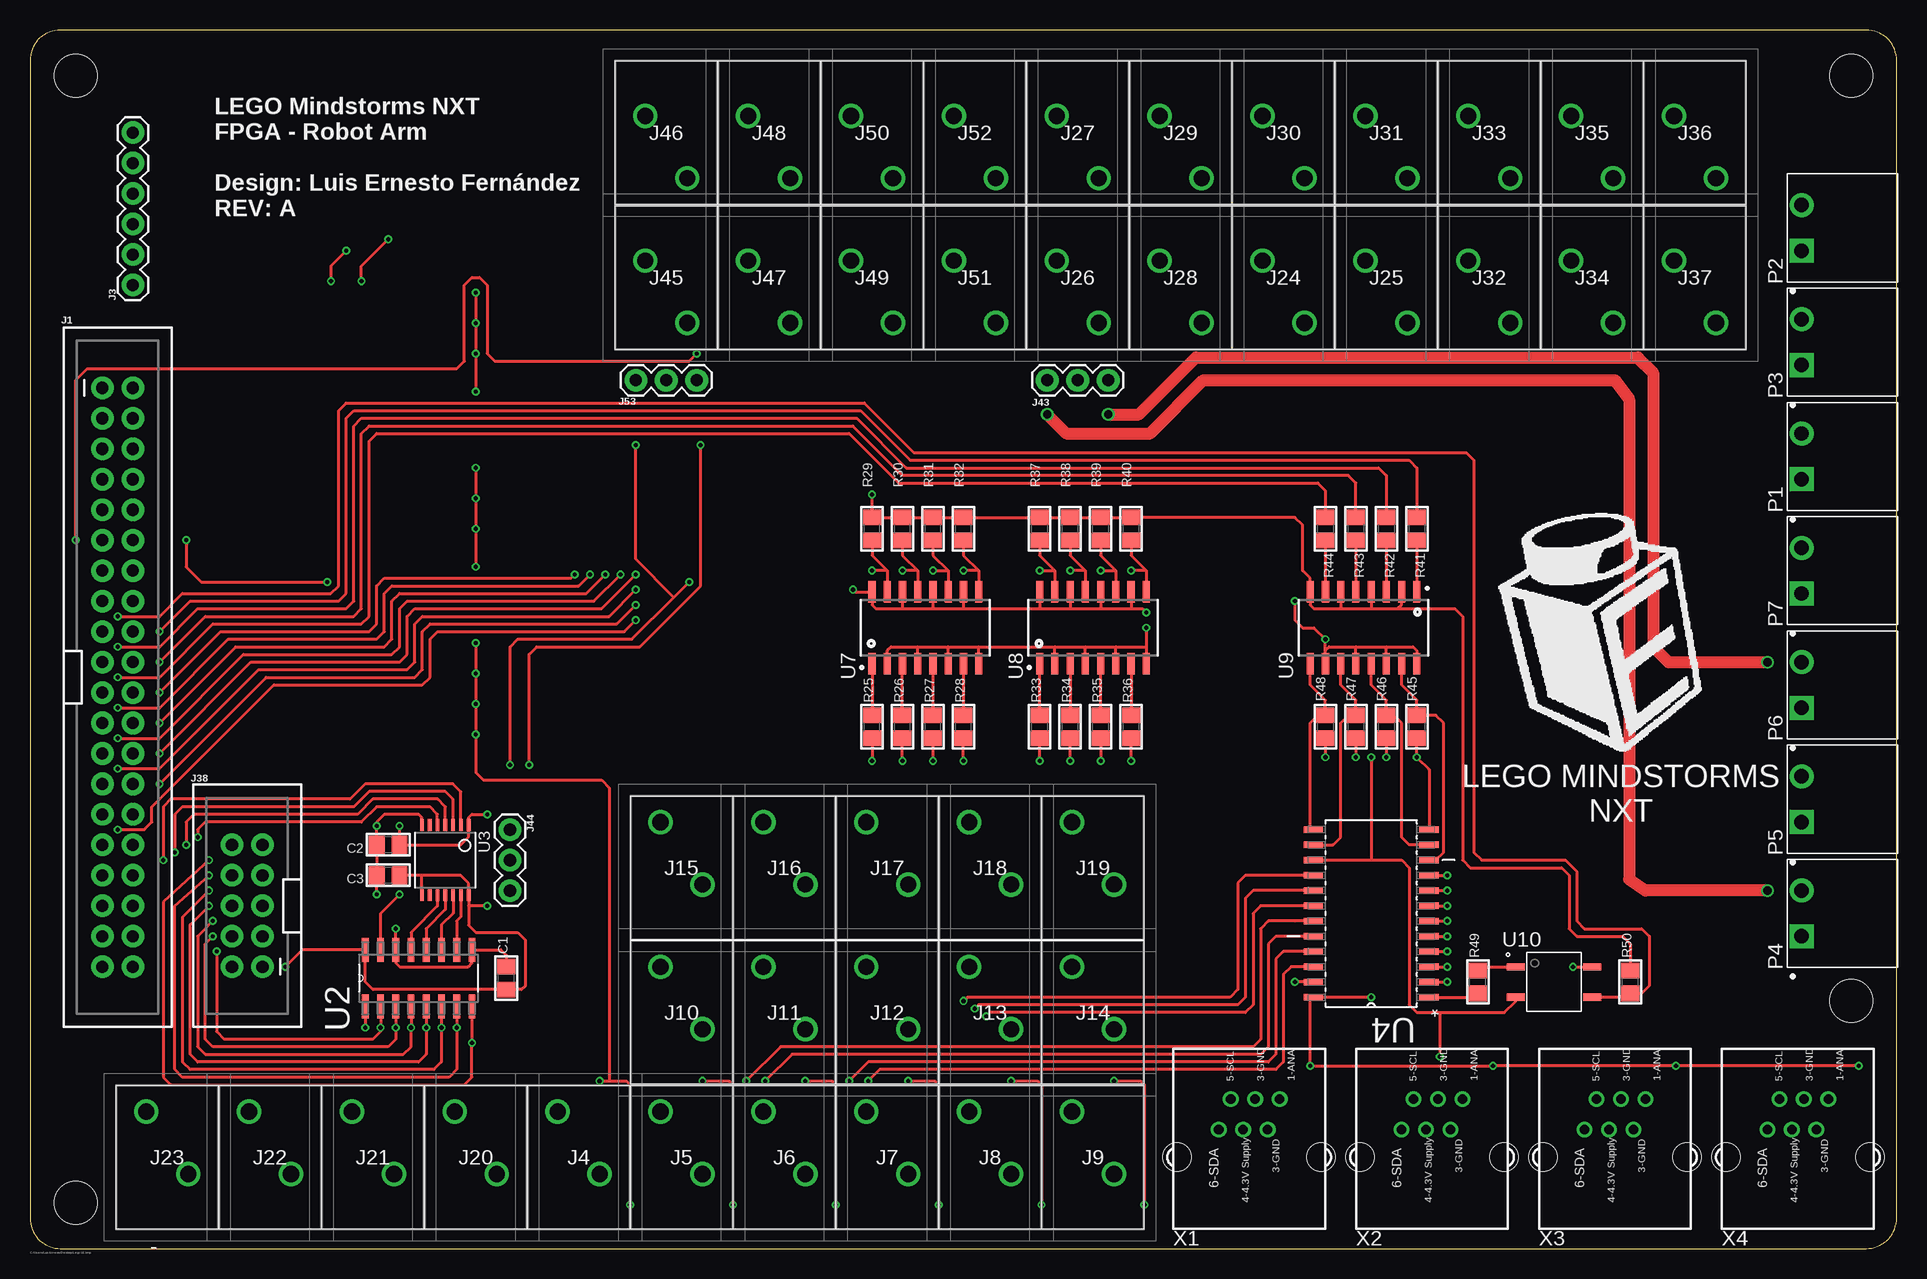
[diagram p4: board, top side]
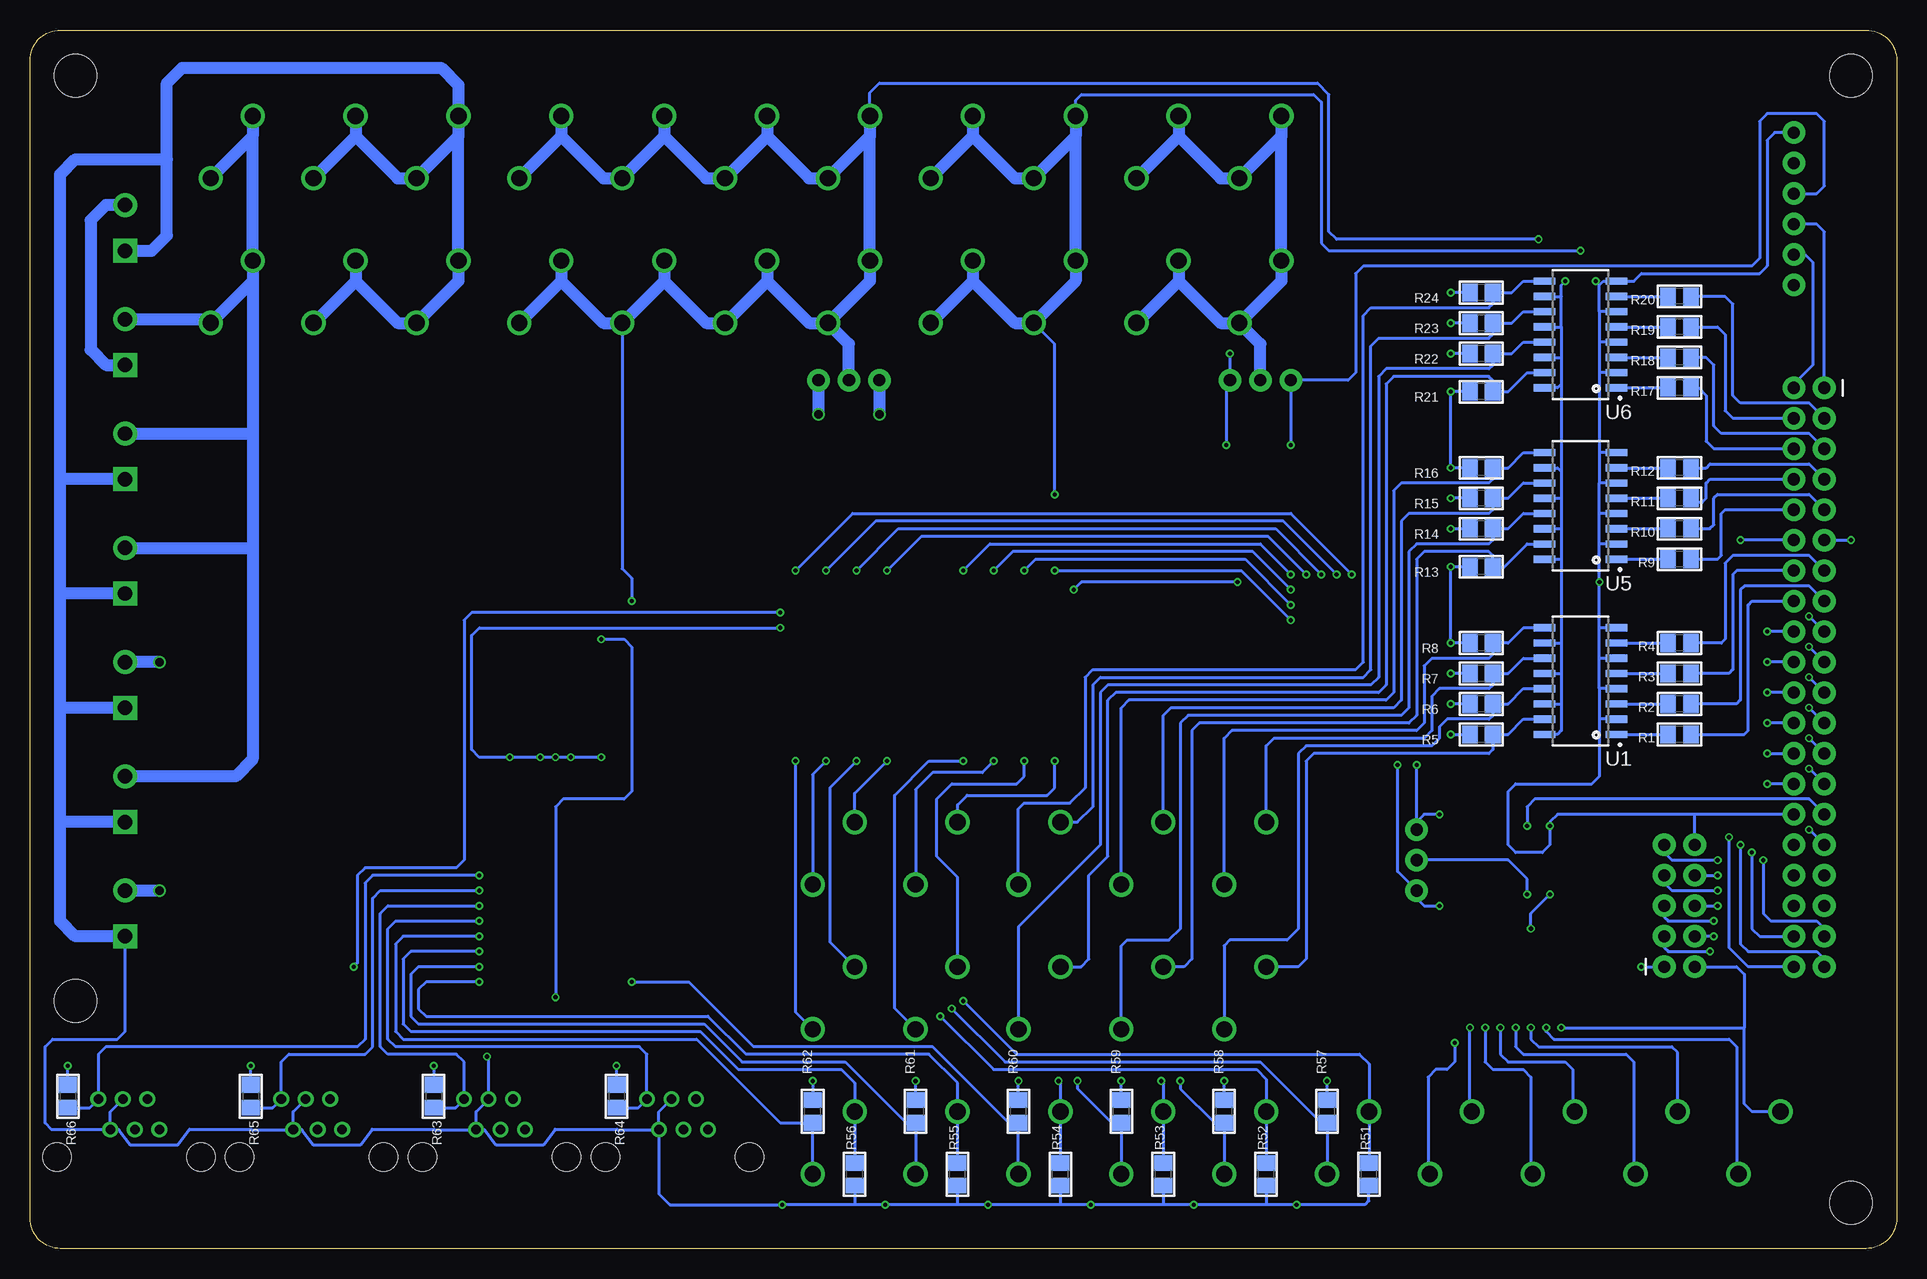
[diagram p5: board, bottom side, seen from below]

Size 155.56 x 101.59 mm. Coordinates in mm from the lower left corner, seen from the top.
Outline: 153.01,101.59 2.54,101.59 arc90 0,99.05 0,2.54 arc90 2.54,0 153.01,0 arc90 155.56,2.54 155.56,99.05 arc90 153.01,101.59
Copper layers (1*16): Top 0.035mm / dielectric 1.5mm / Bottom 0.035mm
Design rules "SeeedStudio_2layer_DRU_no_angle_20140221": minimum track width 6mil, minimum drill 12mil, track to track 6mil, track to pad 6mil, pad to pad 6mil, via to via 6mil, smd to smd 0mil, copper to edge 10mil, drill to drill 10mil, minimum pad ring 10mil, minimum via ring 6mil, stop-mask expansion 2mil, vias tented up to drill 100mil, thermal gap 10mil
Holes 3.56 mm at 151.76,97.79 3.81,3.81 151.76,20.64 3.81,97.79

### Footprints (pad centres in the part's own frame; a part is rotated, then mirrored left to right if it is on the bottom)
0805_NOTHERMALS = smd 1.3 x 1.5: 1 -0.95,0; 2 0.95,0
2X20_SHROUDED = drill 1.016 pad 1.88: 1 -1.27,24.13; 2 1.27,24.13; 3 -1.27,21.59; 4 1.27,21.59; 5 -1.27,19.05; 6 1.27,19.05; 7 -1.27,16.51; 8 1.27,16.51; 9 -1.27,13.97; 10 1.27,13.97; 11 -1.27,11.43; 12 1.27,11.43; 13 -1.27,8.89; 14 1.27,8.89; 15 -1.27,6.35; 16 1.27,6.35; 17 -1.27,3.81; 18 1.27,3.81; 19 -1.27,1.27; 20 1.27,1.27; 21 -1.27,-1.27; 22 1.27,-1.27; 23 -1.27,-3.81; 24 1.27,-3.81; 25 -1.27,-6.35; 26 1.27,-6.35; 27 -1.27,-8.89; 28 1.27,-8.89; 29 -1.27,-11.43; 30 1.27,-11.43; 31 -1.27,-13.97; 32 1.27,-13.97; 33 -1.27,-16.51; 34 1.27,-16.51; 35 -1.27,-19.05; 36 1.27,-19.05; 37 -1.27,-21.59; 38 1.27,-21.59; 39 -1.27,-24.13; 40 1.27,-24.13
1X06 = drill 1.016 pad 1.88: 1 0,0; 2 2.54,0; 3 5.08,0; 4 7.62,0; 5 10.16,0; 6 12.7,0
128340112 = drill 1.35 pad 2.025: 1 -1.75,3.8; 2 1.75,-1.4
2X5-SHROUDED = drill 1.016 pad 1.88: 1 -1.27,5.08; 2 1.27,5.08; 3 -1.27,2.54; 4 1.27,2.54; 5 -1.27,0; 6 1.27,0; 7 -1.27,-2.54; 8 1.27,-2.54; 9 -1.27,-5.08; 10 1.27,-5.08
1X03 = drill 1.016 pad 1.88: 1 0,0; 2 2.54,0; 3 5.08,0
PHOENIX_1803277 = drill 1.2 pad 2 square: 1 -1.905,0 | drill 1.2 pad 2: 2 1.905,0
SOIC127P686X201-16N = smd 1.82 x 0.6: 1 -3,4.445; 2 -3,3.175; 3 -3,1.905; 4 -3,0.635; 5 -3,-0.635; 6 -3,-1.905; 7 -3,-3.175; 8 -3,-4.445; 9 3,-4.445; 10 3,-3.175; 11 3,-1.905; 12 3,-0.635; 13 3,0.635; 14 3,1.905; 15 3,3.175; 16 3,4.445
SOIC127P600X175-16N = smd 1.981 x 0.559: 1 -2.362,4.445; 2 -2.362,3.175; 3 -2.362,1.905; 4 -2.362,0.635; 5 -2.362,-0.635; 6 -2.362,-1.905; 7 -2.362,-3.175; 8 -2.362,-4.445; 9 2.362,-4.445; 10 2.362,-3.175; 11 2.362,-1.905; 12 2.362,-0.635; 13 2.362,0.635; 14 2.362,1.905; 15 2.362,3.175; 16 2.362,4.445
TSSOP14 = smd 0.305 x 0.991: 1 -1.95,-2.918; 2 -1.3,-2.918; 3 -0.65,-2.918; 4 0,-2.918; 5 0.65,-2.918; 6 1.3,-2.918; 7 1.95,-2.918; 8 1.95,2.918; 9 1.3,2.918; 10 0.65,2.918; 11 0,2.918; 12 -0.65,2.918; 13 -1.3,2.918; 14 -1.95,2.918
SOIC127P1030X265-24N = smd 1.6 x 0.533: 1 -4.826,6.985; 2 -4.826,5.715; 3 -4.826,4.445; 4 -4.826,3.175; 5 -4.826,1.905; 6 -4.826,0.635; 7 -4.826,-0.635; 8 -4.826,-1.905; 9 -4.826,-3.175; 10 -4.826,-4.445; 11 -4.826,-5.715; 12 -4.826,-6.985; 13 4.826,-6.985; 14 4.826,-5.715; 15 4.826,-4.445; 16 4.826,-3.175; 17 4.826,-1.905; 18 4.826,-0.635; 19 4.826,0.635; 20 4.826,1.905; 21 4.826,3.175; 22 4.826,4.445; 23 4.826,5.715; 24 4.826,6.985
SOIC254P695X210-4N = smd 1.5 x 0.6: 1 -3.205,1.27; 2 -3.205,-1.27; 3 3.205,-1.27; 4 3.205,1.27
YH-55-10 = drill 0.8 pad 1.3: 1 2.54,4.84; 2 1.54,2.3; 3 0.5,4.84; 4 -0.5,2.3; 5 -1.54,4.84; 6 -2.54,2.3 | hole 2.36: -6,0; 6,0

### Placement (x,y rotation side)
C1  39.69,22.54 90 top
C2  29.84,33.66 180 top
C3  29.84,31.11 180 top
J1  7.3,47.62 0 top
J3  8.57,80.33 90 top
J4  45.72,7.62 0 top
J5  54.29,7.62 0 top
J6  62.87,7.62 0 top
J7  71.44,7.62 0 top
J8  80.01,7.62 0 top
J9  88.58,7.62 0 top
J10  54.29,19.68 0 top
J11  62.87,19.68 0 top
J12  71.44,19.68 0 top
J13  80.01,19.68 0 top
J14  88.58,19.68 0 top
J15  54.29,31.75 0 top
J16  62.87,31.75 0 top
J17  71.44,31.75 0 top
J18  80.01,31.75 0 top
J19  88.58,31.75 0 top
J20  37.15,7.62 0 top
J21  28.57,7.62 0 top
J22  20,7.62 0 top
J23  11.43,7.62 0 top
J24  104.46,80.96 180 top
J25  113.03,80.96 180 top
J26  87.31,80.96 180 top
J27  87.31,93.03 180 top
J28  95.89,80.96 180 top
J29  95.89,93.03 180 top
J30  104.46,93.03 180 top
J31  113.03,93.03 180 top
J32  121.6,80.96 180 top
J33  121.6,93.03 180 top
J34  130.18,80.96 180 top
J35  130.18,93.03 180 top
J36  138.75,93.03 180 top
J37  138.75,80.96 180 top
J38  18.1,28.57 180 top
J43  84.77,72.39 0 top
J44  40.01,34.92 270 top
J45  53.02,80.96 180 top
J46  53.02,93.03 180 top
J47  61.59,80.96 180 top
J48  61.59,93.03 180 top
J49  70.17,80.96 180 top
J50  70.17,93.03 180 top
J51  78.74,80.96 180 top
J52  78.74,93.03 180 top
J53  50.48,72.39 0 top
P1  147.64,66.04 90 top
P2  147.64,85.09 90 top
P3  147.64,75.56 90 top
P4  147.64,27.94 90 top
P5  147.64,37.47 90 top
P6  147.64,46.99 90 top
P7  147.64,56.52 90 top
R1  18.1,42.86 180 bottom
R2  18.1,45.4 180 bottom
R3  18.1,47.94 180 bottom
R4  18.1,50.48 180 bottom
R5  34.61,42.86 180 bottom
R6  34.61,45.4 180 bottom
R7  34.61,47.94 180 bottom
R8  34.61,50.48 180 bottom
R9  18.1,57.47 180 bottom
R10  18.1,60.01 180 bottom
R11  18.1,62.55 180 bottom
R12  18.1,65.09 180 bottom
R13  34.61,56.83 180 bottom
R14  34.61,60.01 180 bottom
R15  34.61,62.55 180 bottom
R16  34.61,65.09 180 bottom
R17  18.1,71.75 180 bottom
R18  18.1,74.3 180 bottom
R19  18.1,76.83 180 bottom
R20  18.1,79.38 180 bottom
R21  34.61,71.44 180 bottom
R22  34.61,74.61 180 bottom
R23  34.61,77.15 180 bottom
R24  34.61,79.69 180 bottom
R25  70.17,43.5 90 top
R26  72.71,43.5 90 top
R27  75.25,43.5 90 top
R28  77.79,43.5 90 top
R29  70.17,60.01 90 top
R30  72.71,60.01 90 top
R31  75.25,60.01 90 top
R32  77.79,60.01 90 top
R33  84.14,43.5 90 top
R34  86.68,43.5 90 top
R35  89.22,43.5 90 top
R36  91.76,43.5 90 top
R37  84.14,60.01 90 top
R38  86.68,60.01 90 top
R39  89.22,60.01 90 top
R40  91.76,60.01 90 top
R41  115.57,60.01 270 top
R42  113.03,60.01 270 top
R43  110.49,60.01 270 top
R44  107.95,60.01 270 top
R45  115.57,43.5 270 top
R46  113.03,43.5 270 top
R47  110.49,43.5 270 top
R48  107.95,43.5 270 top
R49  120.65,22.23 90 top
R50  133.35,22.23 90 top
R51  43.97,6.19 90 bottom
R52  52.55,6.19 90 bottom
R53  61.12,6.19 90 bottom
R54  69.69,6.19 90 bottom
R55  78.26,6.19 90 bottom
R56  86.84,6.19 90 bottom
R57  47.47,11.43 90 bottom
R58  56.04,11.43 90 bottom
R59  64.61,11.43 90 bottom
R60  73.18,11.43 90 bottom
R61  81.76,11.43 90 bottom
R62  90.33,11.43 90 bottom
R63  121.92,12.7 270 bottom
R64  106.68,12.7 270 bottom
R65  137.16,12.7 270 bottom
R66  152.4,12.7 270 bottom
U1  26.35,47.31 180 bottom
U2  32.38,22.54 90 top
U3  34.61,32.38 180 top
U4  111.76,27.94 180 top
U5  26.35,61.91 180 bottom
U6  26.35,76.2 180 bottom
U7  74.61,51.75 90 top
U8  88.58,51.75 90 top
U9  111.12,51.75 270 top
U10  127,22.23 0 top
X1  101.6,7.62 0 top
X2  116.84,7.62 0 top
X3  132.08,7.62 0 top
X4  147.32,7.62 0 top

### Tracks (layer width: path | path; a pad name or v marks a point on that pad's centre or on a via)
0_DIRECTION
  Bottom 0.254: U1.13 31.11,46.67 32.38,45.4 R6.1 33.66,44.45 33.97,44.13 37.47,44.13 38.1,43.5 38.1,42.55 38.73,41.91 49.21,41.91 49.85,41.27 49.85,26.67 50.8,25.72 55.56,25.72 56.04,25.24 J10.2
0_ENABLE
  Bottom 0.254: U1.15 31.11,44.13 32.38,42.86 R5.1 33.66,41.59 33.97,41.27 48.58,41.27 49.21,40.64 49.21,24.13 49.85,23.5 52.53,23.5 J10.1
0_PWM
  Bottom 0.254: U1.11 31.11,49.21 32.38,47.94 R7.1 33.66,46.99 33.97,46.67 38.1,46.67 38.73,46.04 38.73,43.18 39.37,42.55 51.91,42.55 52.54,41.91 J15.1
1_DIRECTION
  Bottom 0.254: U5.15 30.8,58.74 32.7,56.83 R13.1 33.66,57.78 33.97,58.1 39.37,58.1 40.01,57.47 40.01,44.45 40.64,43.81 58.1,43.81 58.74,43.18 58.74,24.13 59.38,23.48 J11.1
1_ENABLE
  Bottom 0.254: U1.9 31.11,51.75 32.38,50.48 R8.1 33.66,49.53 33.97,49.21 38.73,49.21 39.37,48.58 39.37,43.81 40.01,43.18 55.41,43.18 56.04,42.55 J15.2
1_PWM
  Bottom 0.254: U5.13 31.11,61.28 32.38,60.01 R14.1 33.66,59.05 33.97,58.74 40.01,58.74 40.64,58.1 40.64,45.09 41.27,44.45 59.05,44.45 59.69,43.81 59.69,26.67 60.64,25.72 64.14,25.72 64.61,25.24 J11.2
2_DIRECTION
  Bottom 0.254: U5.9 31.11,66.36 32.38,65.09 R16.1 33.66,64.13 33.97,63.82 41.27,63.82 41.91,63.18 41.91,46.35 42.55,45.72 63.98,45.72 64.61,45.09 J16.2
2_ENABLE
  Bottom 0.254: U5.11 31.11,63.82 32.38,62.55 R15.1 33.66,61.59 33.97,61.28 40.64,61.28 41.27,60.64 41.27,45.72 41.91,45.09 60.48,45.09 61.12,44.45 J16.1
2_PWM
  Bottom 0.254: U6.15 30.8,73.03 32.38,71.44 R21.1 33.66,72.39 33.97,72.71 41.91,72.71 42.55,72.07 42.55,46.99 43.18,46.35 65.09,46.35 65.72,45.72 65.72,32.7 67.31,31.11 67.31,24.13 67.95,23.48 J12.1
3.3V  (via drill 0.35)
  Top 0.254: v38.1,36.2 36.83,36.2 36.56,35.92 U3.1 36.56,34.34 35.88,33.66 C2.1 v30.8,35.24 | 72.71,53.34 70.48,53.34 70.17,53.66 U7.16 68.75,54.75 v68.58,54.93 | 72.71,53.34 75.25,53.34 | U7.12 75.25,53.34 | U7.14 72.71,53.34 | 86.68,53.34 89.22,53.34 | U8.12 89.22,53.34 | U8.14 86.68,53.34 | 75.25,53.34 77.79,53.34 | 77.79,53.34 84.14,53.34 | 84.14,53.34 86.68,53.34 | U8.16 84.14,53.34 | U7.10 77.79,53.34 | 89.22,53.34 91.76,53.34 | 91.76,53.34 92.71,53.34 v93.03,53.02 | U8.10 91.76,53.34 | v128.59,23.5 U10.4 | v50.48,66.99 50.48,57.47 53.66,54.29 | v40.01,40.32 40.01,50.16 40.64,50.8 50.16,50.8 53.66,54.29 | 53.66,54.29 v54.93,55.56
  Bottom 0.254: v38.1,36.2 39.37,36.2 40.01,35.56 J44.1 v40.01,40.32 | J1.29 7.3,37.47 30.16,37.47 30.8,36.83 v30.8,35.24 | v93.03,53.02 118.75,53.02 119.38,52.39 119.38,32.38 120.02,31.75 127.64,31.75 128.27,31.11 128.27,23.81 v128.59,23.5 | J3.4 6.67,87.95 6.03,88.58 6.03,93.98 6.67,94.61 10.79,94.61 11.43,93.98 11.43,82.55 12.06,81.92 44.45,81.92 45.09,81.28 45.09,73.03 45.72,72.39 J53.1 v50.48,66.99 | v54.93,55.56 67.94,55.56 v68.58,54.93
3.3V_ANALOG  (via drill 0.7)
  Top 1.016: v144.78,29.84 134.62,29.84 133.26,30.78 133.26,70.78 132.08,72.39 97.79,72.39 93.34,67.94 86.36,67.94 v84.77,69.53
  Bottom 1.016: J43.1 v84.77,69.53 | P4.2 v144.78,29.84
3_DIRECTION
  Bottom 0.254: U6.11 31.11,78.11 32.07,77.15 R23.1 33.66,76.2 33.97,75.88 43.18,75.88 43.81,75.25 43.81,48.26 44.45,47.62 66.36,47.62 66.99,46.99 66.99,36.83 68.27,35.55 J17.1
3_ENABLE
  Bottom 0.254: U6.13 31.11,75.56 32.07,74.61 R22.1 33.66,73.66 33.97,73.34 42.55,73.34 43.18,72.71 43.18,47.62 43.81,46.99 65.72,46.99 66.36,46.35 66.36,33.66 73.19,26.82 J12.2
3_PWM
  Bottom 0.254: U6.9 31.11,80.64 32.07,79.69 R24.1 33.66,78.74 33.97,78.42 43.81,78.42 44.45,77.79 44.45,48.9 45.09,48.26 66.99,48.26 67.63,47.62 67.63,38.42 68.9,37.15 72.71,37.15 73.19,36.67 J17.2
5V  (via drill 0.35)
  Top 0.254: C1.1 | C1.1 28.57,21.59 27.94,22.23 U2.16 22.68,24.91 v21.27,23.5 | 36.56,28.57 U3.14 36.56,30.43 35.88,31.11 32.7,31.11 | 36.56,28.57 36.56,26.94 37.15,26.35 40.64,26.35 41.27,25.72 41.27,21.91 40.96,21.59 C1.1 | v38.1,28.57 36.56,28.57 | 32.7,31.11 C3.1 | U3.8 32.66,31.07 32.7,31.11 | v41.59,40.32 41.59,49.53 42.23,50.16 50.8,50.16 55.88,55.24 v55.88,66.99 | v3.81,59.05 3.81,72.39 4.76,73.34 35.56,73.34 36.2,73.98 36.2,80.33 36.83,80.96 37.47,80.96 38.1,80.33 38.1,74.61 38.73,73.98 54.93,73.98 v55.56,74.61
  Bottom 0.254: v38.1,28.57 39.37,28.57 40.01,29.21 J44.3 41.59,31.43 v41.59,40.32 | v21.27,23.5 J38.1 | v55.88,66.99 55.88,72.07 J53.3 v55.56,74.61 | J1.11 v3.81,59.05
5V_ANALOG  (via drill 0.7)
  Top 1.016: v89.85,69.53 92.39,69.53 97.16,74.3 133.99,74.3 135.25,73.03 135.25,50.16 136.53,48.9 v144.78,48.9
  Bottom 1.016: J43.3 v89.85,69.53 | v144.78,48.9 P6.2
12V
  Bottom 1.016: J36.2 137,92.73 | 137,92.73 J36.1 | 137,80.66 J37.2 137,92.73 | 137,80.66 J37.1 | P3.2 140.81,77.47 J37.1 | 140.34,77 J37.1 | 137,80.66 137,67.94 | 137,67.94 137,58.42 | 137,58.42 137,40.8 138.43,39.37 P5.2 | P1.2 137,67.94 | P7.2 137,58.42
12V_ANALOG
  Bottom 1.016: P2.2 149.22,87 150.5,85.72 150.5,74.93 149.22,73.66 P3.1
ADC_0  (via drill 0.35)
  Top 0.254: U2.1 v27.94,18.41
  Bottom 0.254: v27.94,18.41 12.7,18.41 | 12.7,18.41 12.7,12.06 12.05,11.42 J23.1 | J38.2 13.34,23.5 12.7,22.86 12.7,18.41
ADC_1  (via drill 0.35)
  Top 0.254: U2.2 v29.21,18.41 29.21,18.1 28.57,17.46 16.19,17.46 15.56,18.1 v15.56,24.77
  Bottom 0.254: J23.2 13.34,6.38 13.34,16.83 13.97,17.46 28.57,17.46 29.21,18.1 v29.21,18.41 | J38.3 19.37,25.08 19.05,24.77 v15.56,24.77
ADC_2  (via drill 0.35)
  Top 0.254: U2.3 v30.48,18.41 30.48,17.46 29.84,16.83 15.24,16.83 14.61,17.46 14.61,25.4 v15.24,26.04
  Bottom 0.254: v30.48,18.41 30.48,17.46 29.84,16.83 18.73,16.83 18.25,16.35 J22.1 | v15.24,26.04 J38.4
ADC_3  (via drill 0.35)
  Top 0.254: U2.4 v31.75,18.41 31.75,16.83 31.11,16.19 14.61,16.19 13.97,16.83 13.97,26.04 v15.24,27.3
  Bottom 0.254: v31.75,18.41 31.75,16.83 31.11,16.19 22.54,16.19 21.91,15.56 21.91,6.38 J22.2 | J38.5 19.37,27.62 19.05,27.3 v15.24,27.3
ADC_4  (via drill 0.35)
  Top 0.254: U2.5 v33.02,18.41 33.02,16.19 32.38,15.56 13.97,15.56 13.34,16.19 13.34,26.99 v14.92,28.57
  Bottom 0.254: J21.1 26.99,11.58 26.99,14.92 27.62,15.56 32.38,15.56 33.02,16.19 v33.02,18.41 | J38.6 v14.92,28.57
ADC_5  (via drill 0.35)
  Top 0.254: U2.6 v34.29,18.41 34.29,15.56 33.66,14.92 13.34,14.92 12.7,15.56 12.7,27.62 v14.92,29.84
  Bottom 0.254: J21.2 30.48,6.38 30.48,14.29 31.11,14.92 33.66,14.92 34.29,15.56 v34.29,18.41 | J38.7 19.37,30.48 18.73,29.84 v14.92,29.84
ADC_6  (via drill 0.35)
  Top 0.254: U2.7 v35.56,18.41 35.56,14.92 34.92,14.29 12.7,14.29 12.06,14.92 12.06,28.57 v14.92,31.11
  Bottom 0.254: J20.1 35.56,11.58 v35.56,18.41 | J38.8 v14.92,31.11
ADC_7  (via drill 0.35)
  Top 0.254: U2.8 v36.83,17.14 36.83,14.29 36.2,13.65 11.75,13.65 11.11,14.29 11.11,28.89 v14.92,32.38
  Bottom 0.254: v36.83,17.14 36.83,15.56 37.47,14.92 38.42,14.92 39.05,14.29 39.05,6.38 J20.2 | J38.9 19.37,33.02 18.73,32.38 v14.92,32.38
AGND  (via drill 0.35)
  Top 0.254: R48.2 v107.95,40.96 | R45.2 v115.57,40.96 116.59,39.94 U4.12 | R46.2 v113.03,40.96 | R47.2 v110.49,40.96 | v47.47,13.97 48.26,13.97 | 48.26,13.97 49.69,13.97 50.01,13.65 v50.01,3.65 | v56.04,13.97 58.26,13.97 58.58,13.65 v58.58,3.65 | v64.61,13.97 66.83,13.97 67.15,13.65 v67.15,3.65 | v73.18,13.97 75.41,13.97 75.72,13.65 v75.72,3.65 | v81.76,13.97 83.98,13.97 84.3,13.65 v84.3,3.65 | v90.33,13.97 92.55,13.97 92.87,13.65 v92.87,3.65 | U4.15 111.76,32.38 | 111.76,32.38 114.3,32.38 114.94,31.75 114.94,20.32 115.57,19.68 117.47,19.68 | 117.47,19.68 122.87,19.68 123.8,20.61 U10.2 | v111.76,40.96 111.76,32.38 | v37.15,79.69 v37.15,77.15 v37.15,74.61 v37.15,71.44 | v37.15,65.09 v37.15,62.55 v37.15,60.01 v37.15,56.83 | v37.15,50.48 v37.15,47.94 v37.15,45.4 v37.15,42.86 37.15,39.69 37.78,39.05 47.62,39.05 48.26,38.42 48.26,13.97 | v93.03,51.75 93.03,50.16 | 93.03,50.16 U8.8 | U7.2 71.44,49.85 71.75,50.16 73.98,50.16 | 73.98,50.16 76.52,50.16 | 76.52,50.16 79.06,50.16 | 79.06,50.16 85.41,50.16 | 85.41,50.16 87.95,50.16 | 87.95,50.16 90.49,50.16 | 90.49,50.16 93.03,50.16 | U8.6 90.49,50.16 | U8.4 87.95,50.16 | U8.2 85.41,50.16 | U7.8 79.06,50.16 | U7.6 76.52,50.16 | U7.4 73.98,50.16 | 117.47,19.68 v117.47,16
  Bottom 0.254: X1.2 103.14,11.42 X1.3 | X2.2 118.38,11.42 X2.3 117.34,15.86 v117.47,16 | X3.2 133.62,11.42 X3.3 | X4.2 148.86,11.42 X4.3 | X2.2 121.86,9.92 121.88,9.94 127.04,9.94 128,8.67 131.97,8.67 132.9,9.92 X3.2 | X3.2 137.09,9.92 137.12,9.94 142.28,9.94 143.24,8.67 147.21,8.67 148.14,9.92 X4.2 | X1.2 106.61,9.92 106.64,9.94 111.8,9.94 112.76,8.67 116.73,8.67 117.66,9.92 X2.2 | v107.95,40.96 v110.49,40.96 v111.76,40.96 v113.03,40.96 v115.57,40.96 118.11,40.96 118.75,41.59 118.75,51.12 118.11,51.75 v93.03,51.75 | 52.55,3.65 v50.01,3.65 44.29,3.65 43.97,3.97 R51.1 | 52.55,3.65 v58.58,3.65 61.12,3.65 | 61.12,3.65 v67.15,3.65 69.69,3.65 | 69.69,3.65 v75.72,3.65 78.26,3.65 | 78.26,3.65 v84.3,3.65 86.84,3.65 | R57.2 v47.47,13.97 | v90.33,13.97 R62.2 | R61.2 v81.76,13.97 | R60.2 v73.18,13.97 | R59.2 v64.61,13.97 | R58.2 v56.04,13.97 | 86.84,3.65 v92.87,3.65 102.23,3.65 103.14,4.56 X1.2 | R52.1 52.55,3.65 | R53.1 61.12,3.65 | R54.1 69.69,3.65 | R55.1 78.26,3.65 | R56.1 86.84,3.65 | X4.2 153.75,9.92 154.31,10.48 154.31,16.83 153.67,17.46 148.27,17.46 147.64,18.1 P4.1 | R24.2 v37.15,79.69 | v37.15,42.86 R5.2 | R6.2 v37.15,45.4 | R7.2 v37.15,47.94 | R8.2 v37.15,50.48 v37.15,56.83 R13.2 | v37.15,60.01 R14.2 | R15.2 v37.15,62.55 | R16.2 v37.15,65.09 v37.15,71.44 R21.2 | R22.2 v37.15,74.61 | R23.2 v37.15,77.15
  Bottom 1.016: 119.85,92.73 J33.2 119.85,96.99 121.28,98.42 142.88,98.42 144.15,97.16 144.15,90.81 | 119.85,92.73 J33.1 124.92,89.23 128.43,92.73 | J35.2 128.43,92.73 | 128.43,92.73 J35.1 | J34.2 128.43,80.66 | 128.43,80.66 J34.1 | 128.43,80.66 124.92,77.16 J32.1 119.85,80.66 J32.2 119.85,92.73 | 144.15,90.81 151.76,90.81 153.03,89.53 153.03,64.14 | P2.1 145.41,83.19 144.15,84.45 144.15,90.81 | P4.1 151.76,26.04 153.03,27.3 153.03,35.56 | 153.03,35.56 153.03,45.09 | 153.03,45.09 153.03,54.61 | 153.03,54.61 153.03,64.14 | P1.1 153.03,64.14 | P7.1 153.03,54.61 | P6.1 153.03,45.09 | P5.1 153.03,35.56
CLK  (via drill 0.35)
  Top 0.254: U3.5 33.96,36.21 33.34,36.83 28.89,36.83 27.62,35.56 14.61,35.56 13.97,34.92 v13.97,34.29
  Bottom 0.254: J1.40 12.38,23.5 13.97,25.08 v13.97,34.29
CS  (via drill 0.35)
  Top 0.254: U3.2 35.91,38.07 35.24,38.73 27.94,38.73 26.67,37.47 11.75,37.47 11.11,36.83 v11.11,32.38
  Bottom 0.254: v11.11,32.38 11.11,27.94 10.48,27.3 6.67,27.3 6.03,26.67 J1.37
ENCODER_0_T1  (via drill 0.35)
  Top 0.254: R29.1 70.17,57.78 71.44,56.52 | 71.44,56.52 U7.15 | v7.3,34.92 9.53,34.92 10.16,35.56 10.16,36.83 20.32,46.99 32.7,46.99 33.34,47.62 33.34,50.8 33.97,51.44 49.53,51.44 v50.48,52.39 | 71.44,56.52 v70.17,56.52
  Bottom 0.254: J1.31 v7.3,34.92 | v70.17,56.52 54.61,56.52 v50.48,52.39
ENCODER_0_T2  (via drill 0.35)
  Top 0.254: R30.1 72.71,57.78 73.98,56.52 | 73.98,56.52 U7.13 | v10.79,38.73 19.68,47.62 32.07,47.62 32.7,48.26 32.7,51.44 33.34,52.07 48.9,52.07 v50.48,53.66 | 73.98,56.52 v72.71,56.52
  Bottom 0.254: J1.28 v10.79,38.73 | v72.71,56.52 71.75,57.47 54.29,57.47 v50.48,53.66
ENCODER_1_T1  (via drill 0.35)
  Top 0.254: R31.1 75.25,57.78 76.52,56.52 | 76.52,56.52 U7.11 | v7.3,40.01 10.79,40.01 19.05,48.26 31.43,48.26 32.07,48.9 32.07,52.07 32.7,52.7 48.26,52.7 v50.48,54.93 | v75.25,56.52 76.52,56.52
  Bottom 0.254: J1.27 v7.3,40.01 | v50.48,54.93 53.66,58.1 73.66,58.1 v75.25,56.52
ENCODER_1_T2  (via drill 0.35)
  Top 0.254: R32.1 77.79,57.78 79.06,56.52 | 79.06,56.52 U7.9 | v10.79,41.27 18.41,48.9 30.8,48.9 31.43,49.53 31.43,52.7 32.07,53.34 47.62,53.34 v50.48,56.2 | 79.06,56.52 v77.79,56.52
  Bottom 0.254: v10.79,41.27 J1.26 | v77.79,56.52 75.56,58.74 53.02,58.74 v50.48,56.2
ENCODER_2_T1  (via drill 0.35)
  Top 0.254: 85.41,56.52 84.14,57.78 R37.1 | 85.41,56.52 U8.15 | v7.3,42.55 10.79,42.55 17.78,49.53 30.16,49.53 30.8,50.16 30.8,53.34 31.43,53.98 46.99,53.98 v49.21,56.2 | v84.14,56.52 85.41,56.52
  Bottom 0.254: J1.25 v7.3,42.55 | v49.21,56.2 52.39,59.37 81.28,59.37 v84.14,56.52
ENCODER_2_T2  (via drill 0.35)
  Top 0.254: R38.1 86.68,57.78 87.95,56.52 | 87.95,56.52 U8.13 | v10.79,43.81 17.14,50.16 29.53,50.16 30.16,50.8 30.16,53.98 30.8,54.61 46.35,54.61 v47.94,56.2 | 87.95,56.52 v86.68,56.52
  Bottom 0.254: J1.24 v10.79,43.81 | v86.68,56.52 83.19,60.01 51.75,60.01 v47.94,56.2
ENCODER_3_T1  (via drill 0.35)
  Top 0.254: 90.49,56.52 89.22,57.78 R39.1 | 90.49,56.52 U8.11 | v7.3,45.09 10.79,45.09 16.51,50.8 28.89,50.8 29.53,51.44 29.53,54.61 30.16,55.24 45.72,55.24 v46.67,56.2 | v89.22,56.52 90.49,56.52
  Bottom 0.254: J1.23 v7.3,45.09 | v46.67,56.2 51.12,60.64 85.09,60.64 v89.22,56.52
ENCODER_3_T2  (via drill 0.35)
  Top 0.254: R40.1 91.76,57.78 93.03,56.52 | 93.03,56.52 U8.9 | v10.79,46.35 15.88,51.44 28.26,51.44 28.89,52.07 28.89,55.24 29.53,55.88 45.09,55.88 v45.4,56.2 | 93.03,56.52 v91.76,56.52
  Bottom 0.254: J1.22 v10.79,46.35 | v91.76,56.52 87,61.28 50.48,61.28 v45.4,56.2
GND  (via drill 0.35)
  Top 0.254: C1.2 39.69,24.45 39.23,24.91 U2.9 36.83,23.81 36.51,23.5 30.8,23.5 30.48,23.81 U2.14 v30.48,26.67 | 32.66,35.6 U3.7 32.66,35.92 32.38,36.2 29.53,36.2 28.89,35.56 v28.89,35.24 C2.2 C3.2 v28.89,29.53 | 109.22,53.34 107,53.34 106.68,53.66 U9.8 106.68,55.88 106.05,56.52 106.05,60.33 105.41,60.96 R40.2 R39.2 R38.2 R37.2 R32.2 R31.2 R30.2 R29.2 v70.17,62.87 | 109.22,53.34 111.76,53.34 | 111.76,53.34 113.98,53.34 | 113.98,53.34 114.3,53.66 U9.2 | U9.4 111.76,53.34 | U9.6 109.22,53.34 | v13.02,59.05 13.02,56.83 14.29,55.56 v24.77,55.56 | 113.98,53.34 118.75,53.34 119.38,52.7 119.38,32.38 120.02,31.75 127.64,31.75 128.27,31.11 128.27,26.67 128.91,26.04 132.72,26.04 133.35,25.4 R50.2 | v25.08,80.64 25.08,81.92 v26.35,83.19
  Bottom 0.254: J1.30 16.83,36.2 | 16.83,36.2 28.26,36.2 28.89,35.56 v28.89,35.24 C2.2 29.53,33.02 31.75,33.02 32.38,33.66 32.38,38.1 31.75,38.73 25.4,38.73 24.77,39.37 24.77,44.13 | 24.77,61.28 24.77,63.82 | U5.6 24.77,63.82 | U5.4 24.77,61.28 | 24.77,78.11 24.77,80.33 | 24.77,78.11 24.77,75.56 | U6.6 24.77,78.11 | U6.4 24.77,75.56 | 24.77,75.56 24.77,73.03 | 24.77,73.03 24.77,66.36 | 24.77,66.36 24.77,63.82 | U6.2 24.77,73.03 | U5.8 24.77,66.36 | 24.77,46.67 24.77,49.21 | 24.77,49.21 24.77,51.75 | 24.77,51.75 v24.77,55.56 24.77,58.74 | 24.77,58.74 24.77,61.28 | U1.8 24.77,51.75 | U5.2 24.77,58.74 | U1.6 24.77,49.21 | U1.4 24.77,46.67 | J38.10 16.83,36.2 | v30.48,26.67 30.48,27.94 v28.89,29.53 | J3.6 10.16,93.03 10.79,92.39 10.79,81.92 11.43,81.28 21.27,81.28 21.91,80.64 U6.8 24.45,80.64 24.77,80.33 | J1.12 v13.02,59.05 | v70.17,62.87 70.17,75.41 J49.1 | 24.77,80.33 v25.08,80.64 | J50.2 68.42,95.73 67.94,96.2 48.58,96.2 47.94,95.57 47.94,83.82 47.31,83.19 v26.35,83.19 | 24.77,46.67 24.77,44.13 | U1.2 24.77,44.13
  Bottom 1.016: J50.2 68.42,92.73 | 68.42,92.73 J50.1 73.49,89.23 76.99,92.73 | J52.2 76.99,92.73 | 76.99,92.73 J52.1 | J51.2 76.99,80.66 | 76.99,80.66 J51.1 | 76.99,80.66 73.49,77.16 J49.1 68.42,80.66 J49.2 68.42,92.73
MISO  (via drill 0.35)
  Top 0.254: U3.4 34.61,36.83 33.97,37.47 28.57,37.47 27.3,36.2 13.65,36.2 13.02,35.56 v13.02,33.66
  Bottom 0.254: v13.02,33.66 13.02,25.4 12.38,24.77 6.67,24.77 6.03,24.13 J1.39
MOSI  (via drill 0.35)
  Top 0.254: U3.3 35.26,37.45 34.61,38.1 28.26,38.1 26.99,36.83 12.7,36.83 12.06,36.2 v12.06,33.02
  Bottom 0.254: v12.06,33.02 12.06,26.67 11.43,26.04 J1.38
MOTOR_0_DIR
  Bottom 0.254: J1.15 7.3,55.24 12.7,55.24 13.02,54.93 13.02,45.72 13.34,45.4 R2.1
MOTOR_0_EN
  Bottom 0.254: R1.1 12.7,42.86 12.38,43.18 12.38,53.66 12.06,53.98 J1.16
MOTOR_0_PWM
  Bottom 0.254: J1.14 13.34,56.52 13.65,56.2 13.65,48.26 13.97,47.94 R3.1
MOTOR_0_T1  (via drill 0.35)
  Top 0.254: R25.1 v70.17,40.64
  Bottom 0.254: J18.1 78.26,36.99 77.47,37.78 70.8,37.78 70.17,38.42 v70.17,40.64
MOTOR_0_T2  (via drill 0.35)
  Top 0.254: v72.71,40.64 R26.1
  Bottom 0.254: J13.1 78.26,30.95 80.01,32.7 80.01,37.47 78.74,38.73 73.34,38.73 72.71,39.37 v72.71,40.64
MOTOR_1_DIR
  Bottom 0.254: R9.1 14.92,57.47 14.61,57.78 14.61,61.28 14.29,61.59 J1.10
MOTOR_1_EN
  Bottom 0.254: J1.13 7.3,57.78 13.65,57.78 14.29,57.15 14.29,50.8 14.61,50.48 R4.1
MOTOR_1_PWM
  Bottom 0.254: R10.1 15.56,60.01 15.24,60.33 15.24,62.55 14.92,62.87 7.3,62.87 J1.9
MOTOR_1_T1  (via drill 0.35)
  Top 0.254: R27.1 v75.25,40.64
  Bottom 0.254: v75.25,40.64 76.2,39.69 80.33,39.69 81.76,38.26 J18.2
MOTOR_1_T2  (via drill 0.35)
  Top 0.254: v77.79,40.64 R28.1
  Bottom 0.254: J13.2 83.5,20.03 83.5,37.78 80.64,40.64 v77.79,40.64
MOTOR_2_DIR
  Bottom 0.254: R12.1 15.88,65.09 15.56,65.41 7.3,65.41 J1.7
MOTOR_2_EN
  Bottom 0.254: R11.1 16.83,62.23 16.19,62.23 15.88,62.55 15.88,63.82 15.56,64.14 J1.8
MOTOR_2_PWM
  Bottom 0.254: R17.1 16.51,71.75 15.88,71.12 15.88,67.31 15.24,66.67 J1.6
MOTOR_2_T1  (via drill 0.35)
  Top 0.254: v84.14,40.64 R33.1
  Bottom 0.254: J19.1 86.83,37.95 v84.14,40.64
MOTOR_2_T2  (via drill 0.35)
  Top 0.254: v86.68,40.64 R34.1
  Bottom 0.254: J14.1 88.9,25.55 88.9,38.42 v86.68,40.64
MOTOR_3_DIR
  Bottom 0.254: R19.1 14.92,76.83 14.29,76.2 14.29,69.85 13.65,69.22 J1.4
MOTOR_3_EN
  Bottom 0.254: J1.5 7.3,67.94 14.61,67.94 15.24,68.58 15.24,73.66 15.88,74.3 R18.1
MOTOR_3_PWM
  Bottom 0.254: J1.3 7.3,70.48 13.02,70.48 13.65,71.12 13.65,78.74 14.29,79.38 R20.1
MOTOR_3_T1  (via drill 0.35)
  Top 0.254: R35.1 v89.22,40.64
  Bottom 0.254: v89.22,40.64 90.33,39.52 J19.2
MOTOR_3_T2  (via drill 0.35)
  Top 0.254: v91.76,40.64 R36.1
  Bottom 0.254: J14.2 91.76,19.71 v91.76,40.64
MUX_0  (via drill 0.35)
  Top 0.254: U4.9 v118.11,31.11
  Bottom 0.254: R66.2 150.57,11.75 X4.1 149.86,16.19 149.22,16.83 128.27,16.83 127.64,17.46 127.64,30.48 127,31.11 v118.11,31.11
MUX_1  (via drill 0.35)
  Top 0.254: U4.8 v118.11,29.84
  Bottom 0.254: R65.2 135.33,11.75 X3.1 134.62,15.56 133.99,16.19 127.64,16.19 127,16.83 127,29.21 126.36,29.84 v118.11,29.84
MUX_2  (via drill 0.35)
  Top 0.254: U4.7 v118.11,28.57
  Bottom 0.254: R63.2 120.09,11.75 X2.1 119.38,15.56 120.02,16.19 125.73,16.19 126.36,16.83 126.36,27.94 125.73,28.57 v118.11,28.57
MUX_3  (via drill 0.35)
  Top 0.254: U4.6 v118.11,27.3
  Bottom 0.254: R64.2 104.85,11.75 X1.1 104.14,16.19 104.78,16.83 125.09,16.83 125.73,17.46 125.73,26.67 125.09,27.3 v118.11,27.3
MUX_4  (via drill 0.35)
  Top 0.254: U4.5 v118.11,26.04
  Bottom 0.254: J9.2 R62.1 | R62.1 | v118.11,26.04 124.46,26.04 125.09,25.4 125.09,18.1 124.46,17.46 100.01,17.46 93.03,10.48 R62.1
MUX_5  (via drill 0.35)
  Top 0.254: U4.4 v118.11,24.77
  Bottom 0.254: R56.2 J9.1 86.83,13.81 87.95,14.92 96.52,14.92 99.69,18.1 123.83,18.1 124.46,18.73 124.46,24.13 123.83,24.77 v118.11,24.77
MUX_6  (via drill 0.35)
  Top 0.254: U4.3 v118.11,23.5
  Bottom 0.254: R61.1 | R61.1 J8.2 | v118.11,23.5 123.19,23.5 123.83,22.86 123.83,19.37 123.19,18.73 99.38,18.73 96.2,15.56 87.63,15.56 82.55,10.48 R61.1
MUX_7  (via drill 0.35)
  Top 0.254: U4.2 v118.11,22.23
  Bottom 0.254: R55.2 J8.1 78.26,13.81 80.64,16.19 95.89,16.19 99.06,19.37 122.56,19.37 123.19,20 123.19,21.59 122.56,22.23 v118.11,22.23
MUX_8  (via drill 0.35)
  Top 0.254: U4.23 v105.41,22.23
  Bottom 0.254: J7.2 R60.1 | R60.1 | v105.41,22.23 100.65,22.23 95.25,16.83 80.33,16.83 73.98,10.48 R60.1
MUX_9  (via drill 0.35)
  Top 0.254: U4.22 105.09,23.5 104.46,22.86 104.46,15.56 103.82,14.92 70.8,14.92 v69.85,13.97
  Bottom 0.254: R54.2 J7.1 69.69,13.81 v69.85,13.97
MUX_10  (via drill 0.35)
  Top 0.254: U4.21 104.46,24.77 103.82,24.13 103.82,16.19 103.19,15.56 69.85,15.56 v68.26,13.97
  Bottom 0.254: J6.2 R59.1 65.41,10.48 68.26,13.34 v68.26,13.97
MUX_11  (via drill 0.35)
  Top 0.254: U4.20 103.82,26.04 103.19,25.4 103.19,16.83 102.55,16.19 63.5,16.19 v61.28,13.97
  Bottom 0.254: v61.28,13.97 61.12,13.81 J6.1 R53.2
MUX_12  (via drill 0.35)
  Top 0.254: U4.19 105.41,27.3 103.19,27.3 102.55,26.67 102.55,17.46 101.92,16.83 62.55,16.83 v59.69,13.97
  Bottom 0.254: J5.2 R58.1 56.83,10.48 59.69,13.34 v59.69,13.97
MUX_13  (via drill 0.35)
  Top 0.254: U4.18 102.55,28.57 101.92,27.94 101.92,20.32 101.28,19.68 80.01,19.68 v79.69,19.37
  Bottom 0.254: R52.2 J5.1 52.54,14.12 53.34,14.92 75.25,14.92 v79.69,19.37
MUX_14  (via drill 0.35)
  Top 0.254: U4.17 101.92,29.84 101.28,29.21 101.28,20.95 100.65,20.32 79.06,20.32 v78.74,20
  Bottom 0.254: J4.2 R57.1 47.94,10.48 53.02,15.56 74.3,15.56 v78.74,20
MUX_15  (via drill 0.35)
  Top 0.254: U4.16 101.28,31.11 100.65,30.48 100.65,21.59 100.01,20.95 78.11,20.95 v77.79,20.64
  Bottom 0.254: R51.2 J4.1 43.97,15.39 44.77,16.19 73.34,16.19 v77.79,20.64
MUX_A  (via drill 0.35)
  Top 0.254: v10.79,51.44 13.34,53.98 25.72,53.98 26.35,54.61 26.35,69.22 26.99,69.85 69.22,69.85 73.34,65.72 114.94,65.72 115.57,65.09 R41.1
  Bottom 0.254: J1.18 v10.79,51.44
MUX_A_ANALOG
  Top 0.254: R45.1 | R45.1 115.57,45.72 114.3,46.99 U9.15 | U4.10 117.16,32.38 117.79,33.02 117.79,43.81 117.16,44.45 R45.1
MUX_B  (via drill 0.35)
  Top 0.254: v7.3,50.16 10.79,50.16 13.97,53.34 26.35,53.34 26.99,53.98 26.99,68.58 27.62,69.22 68.9,69.22 73.03,65.09 112.39,65.09 113.03,64.45 R42.1
  Bottom 0.254: J1.19 v7.3,50.16
MUX_B_ANALOG
  Top 0.254: U9.13 111.76,46.99 113.03,45.72 R46.1 113.66,44.45 113.67,44.45 114.3,43.81 114.3,34.29 114.94,33.66 U4.11
MUX_C  (via drill 0.35)
  Top 0.254: v10.79,48.9 14.61,52.7 26.99,52.7 27.62,53.34 27.62,67.94 28.26,68.58 68.58,68.58 72.71,64.45 109.86,64.45 110.49,63.82 R43.1
  Bottom 0.254: J1.20 v10.79,48.9
MUX_C_ANALOG
  Top 0.254: R47.1 | R47.1 110.49,45.72 109.22,46.99 U9.11 | U4.14 108.58,33.66 109.22,34.29 109.22,43.81 109.86,44.45 R47.1
MUX_D  (via drill 0.35)
  Top 0.254: v7.3,47.62 10.79,47.62 15.24,52.07 27.62,52.07 28.26,52.7 28.26,67.31 28.89,67.94 68.26,67.94 72.39,63.82 107.31,63.82 107.95,63.18 R44.1
  Bottom 0.254: J1.21 v7.3,47.62
MUX_D_ANALOG
  Top 0.254: U9.9 106.68,46.99 107.95,45.72 R48.1 107.32,44.45 107.31,44.45 106.68,43.81 106.68,35.18 U4.13
MUX_OUT  (via drill 0.35)
  Top 0.254: R50.1 | R50.1 132.4,20.95 U10.3 | v7.3,52.7 10.79,52.7 12.7,54.61 25.08,54.61 25.72,55.24 25.72,69.85 26.35,70.48 69.53,70.48 73.66,66.36 119.7,66.36 120.33,65.72 120.33,33.02 120.97,32.38 127.95,32.38 128.91,31.43 128.91,27.3 129.54,26.67 134.3,26.67 134.94,26.04 134.94,21.91 134.3,21.27 R50.1
  Bottom 0.254: J1.17 v7.3,52.7
N$1
  Top 0.254: U2.10 35.56,27.3 35.91,27.65 U3.13
N$2
  Top 0.254: U3.11 34.61,28.26 33.02,26.67 U2.12
N$6
  Top 0.254: U3.10 33.96,28.56 31.75,26.35 U2.13
N$15
  Top 0.254: U3.12 35.26,27.95 34.29,26.99 U2.11
N$57
  Bottom 0.254: U1.1 R1.2
N$58
  Bottom 0.254: U1.3 R2.2
N$59
  Bottom 0.254: U1.5 R3.2
N$60
  Bottom 0.254: U1.7 R4.2
N$69
  Top 0.254: R33.2 U8.1
N$70
  Top 0.254: U8.3 R34.2
N$71
  Top 0.254: R35.2 U8.5
N$80
  Top 0.254: U4.1 120.33,20.95 R49.1
N$81
  Top 0.254: U8.7 R36.2
N$82
  Top 0.254: R49.2 120.97,23.5 U10.1
N$83
  Top 0.254: R41.2 U9.1
N$112  (via drill 0.35)
  Top 0.254: U2.15 29.21,27.94 v30.8,29.53
  Bottom 0.254: J44.2 32.38,32.38 30.8,30.8 v30.8,29.53
N$118
  Bottom 0.254: U5.1 R9.2
N$119
  Bottom 0.254: U5.3 R10.2
N$120
  Bottom 0.254: U5.5 R11.2
N$121
  Bottom 0.254: U5.7 R12.2
N$122
  Bottom 0.254: U6.1 R17.2
N$123
  Bottom 0.254: U6.3 R18.2
N$124
  Bottom 0.254: U6.5 R19.2
N$125
  Bottom 0.254: U6.7 R20.2
N$126
  Top 0.254: U7.1 R25.2
N$127
  Top 0.254: R26.2 U7.3
N$128
  Top 0.254: U7.5 R27.2
N$129
  Top 0.254: U7.7 R28.2
N$130
  Top 0.254: R42.2 U9.3
N$131
  Top 0.254: R43.2 U9.5
N$132
  Top 0.254: R44.2 U9.7
RXI
  Bottom 0.254: J3.2 7.62,82.87 6.99,82.23 6.99,73.66 8.57,72.07 J1.2
TXO
  Bottom 0.254: J1.1 6.03,84.77 6.67,85.41 J3.3
VCCA  (via drill 0.35)
  Top 0.254: v152.4,15.24 v137.16,15.24 v121.92,15.24 v106.68,15.24 106.68,20.7 U4.24 v111.76,20.95 | 110.49,50.16 108.27,50.16 107.95,49.85 U9.10 v107.95,50.8 107,51.75 106.05,51.75 105.41,52.39 v105.41,53.98 | 110.49,50.16 113.03,50.16 | 113.03,50.16 115.25,50.16 115.57,49.85 U9.16 | U9.14 113.03,50.16 | U9.12 110.49,50.16 | v27.62,80.64 27.62,81.92 v29.84,84.14
  Bottom 0.254: R64.1 v106.68,15.24 | v121.92,15.24 R63.1 | R65.1 v137.16,15.24 | R66.1 v152.4,15.24 | 27.94,47.94 27.94,45.4 | 27.94,45.4 27.94,43.18 28.26,42.86 U1.16 | U1.14 27.94,45.4 | U1.12 27.94,47.94 | U5.10 28.26,65.09 27.94,64.77 | 27.94,64.77 27.94,62.55 | 27.94,62.55 27.94,60.01 | U5.14 27.94,60.01 | U5.12 27.94,62.55 | 27.94,76.83 27.94,74.3 | 27.94,74.3 27.94,72.07 | 27.94,72.07 28.26,71.75 U6.16 | U6.14 27.94,74.3 | U6.12 27.94,76.83 | v107.95,50.8 106.05,50.8 105.41,50.16 105.41,38.1 106.05,37.47 111.12,37.47 111.76,36.83 v111.76,20.95 | 27.94,72.07 27.94,64.77 | 27.94,60.01 27.94,57.47 | 27.94,57.47 27.94,50.48 | 27.94,50.48 27.94,47.94 | U1.10 27.94,50.48 | U5.16 27.94,57.47 | J24.1 106.21,56.68 105.41,55.88 v105.41,53.98 | v27.62,80.64 27.94,80.33 27.94,79.38 | 27.94,76.83 27.94,79.38 | U6.10 27.94,79.38 | v29.84,84.14 46.67,84.14 47.31,84.77 47.31,96.2 48.26,97.16 84.77,97.16 85.56,96.36 J27.2
  Bottom 1.016: J27.2 85.56,92.73 | 85.56,92.73 J27.1 90.64,89.23 94.14,92.73 | J29.2 94.14,92.73 | 94.14,92.73 J29.1 99.21,89.23 102.71,92.73 | J30.2 102.71,92.73 | 102.71,92.73 J30.1 107.78,89.23 111.28,92.73 | J31.2 111.28,92.73 | 111.28,92.73 J31.1 | J26.1 85.56,80.66 J26.2 85.56,92.73 | J28.2 94.14,80.66 | 94.14,80.66 J28.1 99.21,77.16 102.71,80.66 | J24.2 102.71,80.66 | 102.71,80.66 J24.1 107.78,77.16 111.28,80.66 | J25.2 111.28,80.66 | 111.28,80.66 J25.1 | 94.14,80.66 90.64,77.16 J26.1 | J43.2 87.31,75.41 J26.1
VCCD
  Bottom 1.016: J46.2 51.27,92.73 | 51.27,92.73 J46.1 56.34,89.23 59.84,92.73 | J48.2 59.84,92.73 | 59.84,92.73 J48.1 | J45.1 51.27,80.66 J45.2 51.27,92.73 | J47.2 59.84,80.66 | 59.84,80.66 J47.1 | 59.84,80.66 56.34,77.16 J45.1 | J53.2 53.02,75.41 J45.1

### Text on the board
tPlace: LEGO Mindstorms NXT / FPGA - Robot Arm / / Design: Luis Ernesto Fernández / REV: A | LEGO MINDSTORMS / NXT | C:/Users/Luis Ernesto/Desktop/Lego LE.bmp